# Altium project RK3588.PrjPcb (part 2 of 3)

## Sheet 10.RK3588_VCCIO1_VCCIO3_SARADC.SchDoc
size A3; SheetNumber: 10; SheetTotal: 21
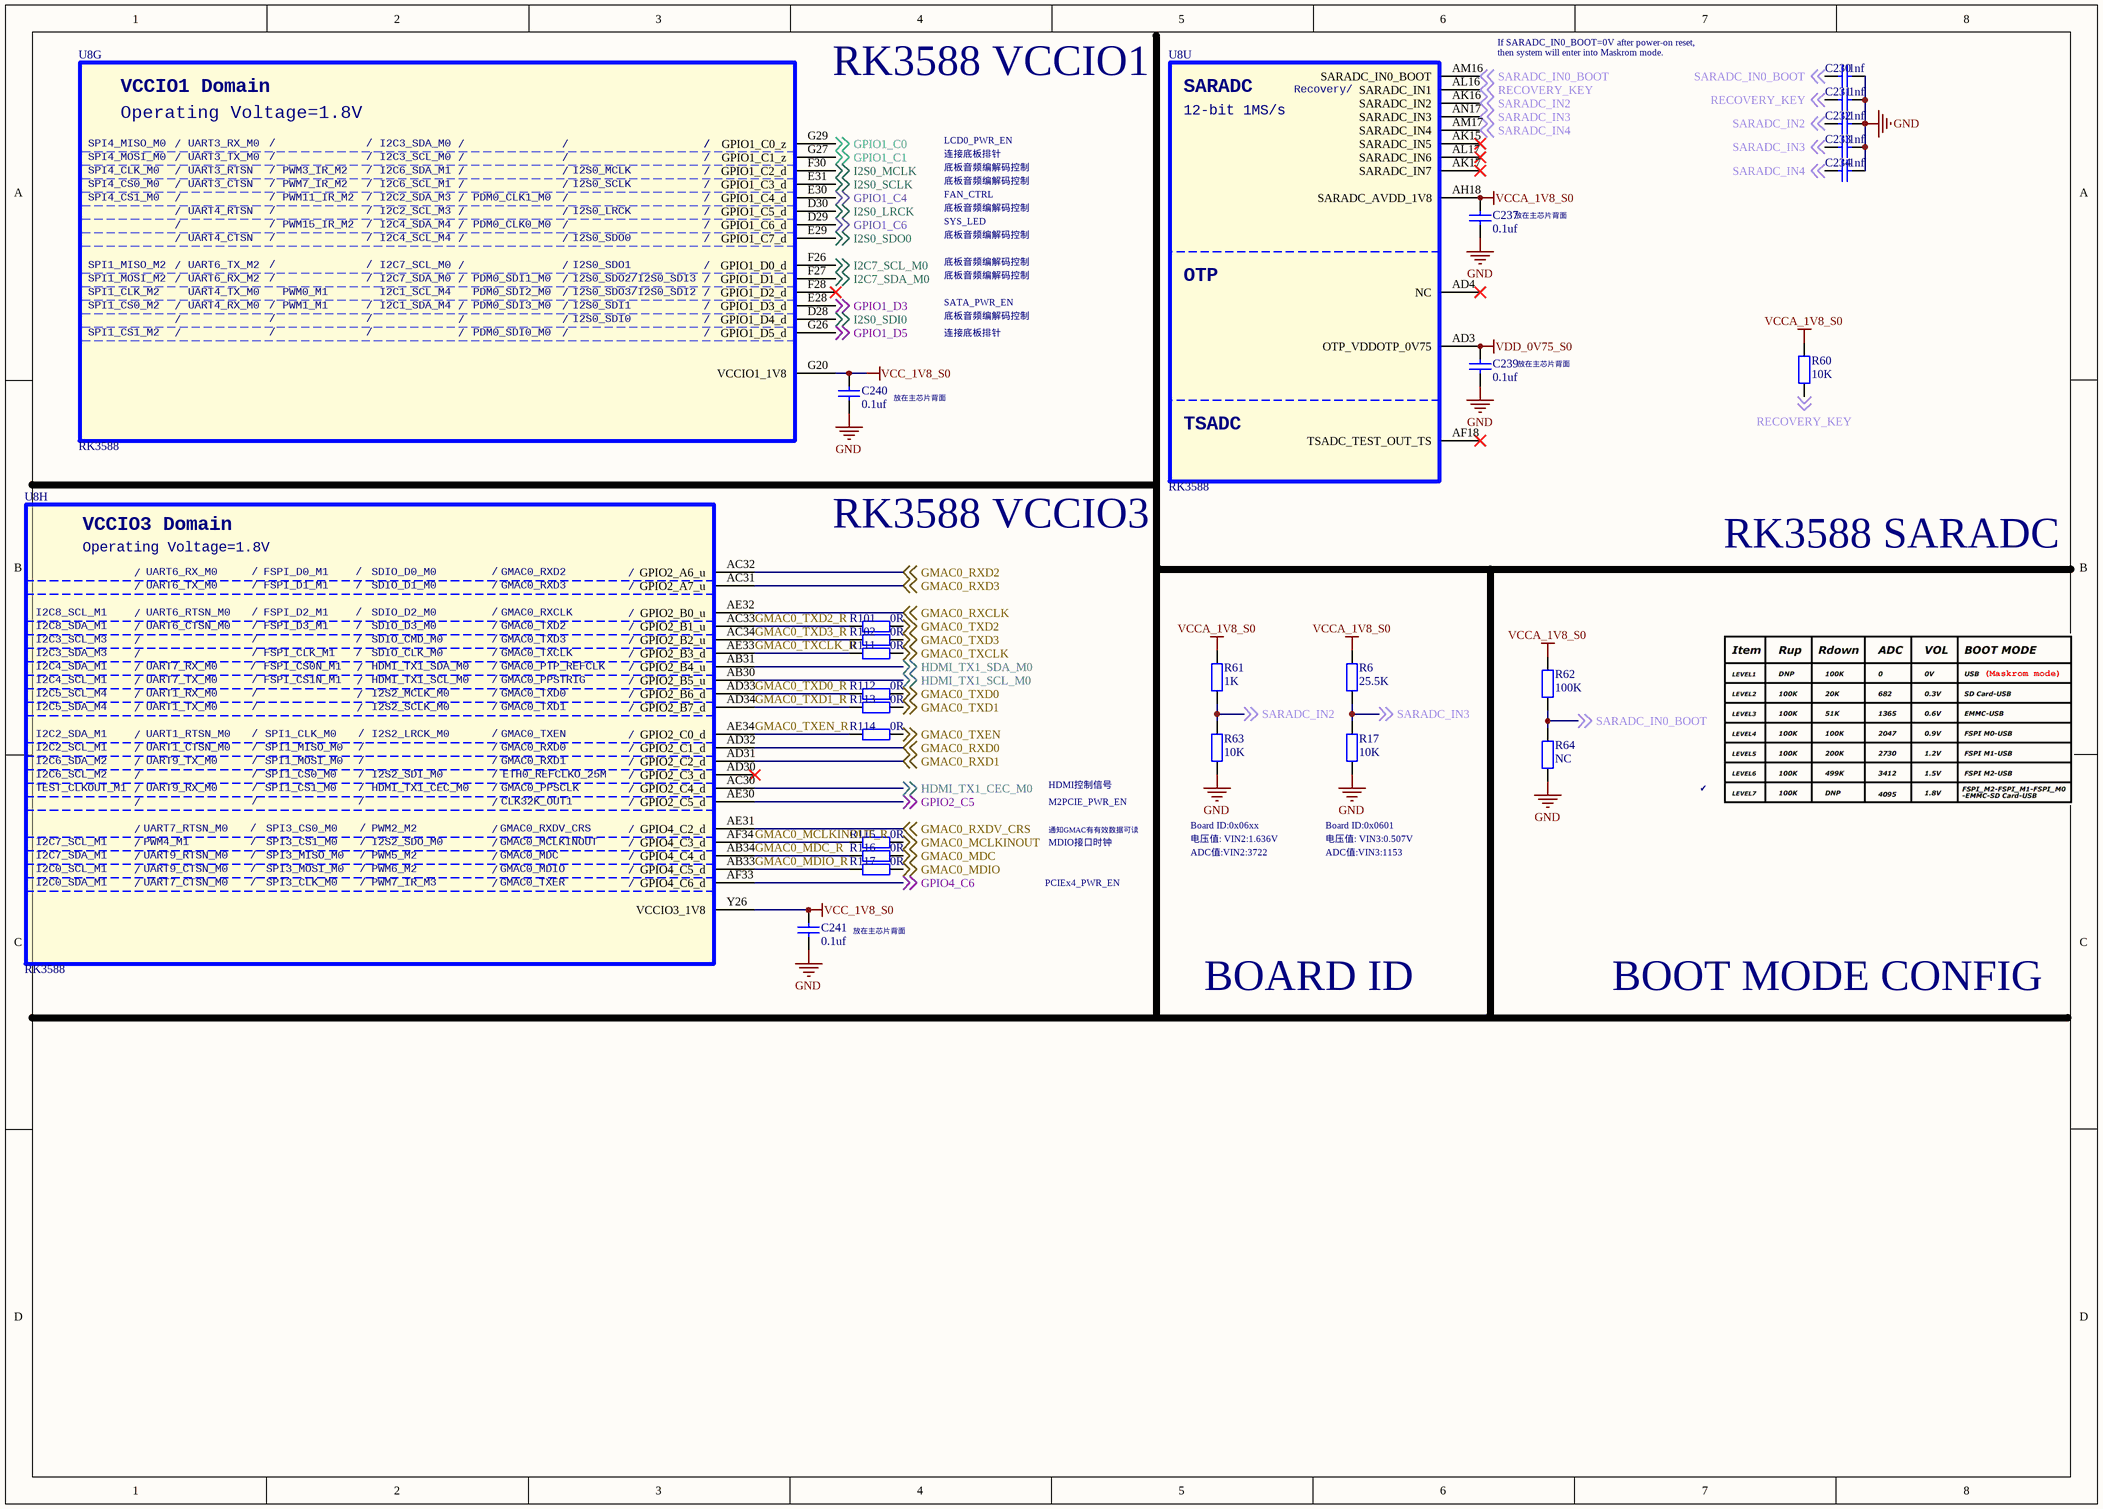
[diagram p9: 10.RK3588_VCCIO1_VCCIO3_SARADC.SchDoc]

### Parts
C230  1nf  [C0201_L]
C231  1nf  [C0201_L]
C232  1nf  [C0201_L]
C233  1nf  [C0201_L]
C234  1nf  [C0201_L]
C237  0.1uf  [C0201_L]
C239  0.1uf  [C0201_L]
C240  0.1uf  [C0201_L]
C241  0.1uf  [C0201_L]
R6  25.5K  [R0402_L]
R17  10K  [R0402_L]
R60  10K  [R0402_L]
R61  1K  [R0402_L]
R62  100K  [R0402_L]
R63  10K  [R0402_L]
R64  NC  [R0402_L]
R101  0R  [R0201_L]
R102  0R  [R0201_L]
R111  0R  [R0201_L]
R112  0R  [R0201_L]
R113  0R  [R0201_L]
R114  0R  [R0201_L]
R115  0R  [R0201_L]
R116  0R  [R0201_L]
R117  0R  [R0201_L]
U8  RK3588  [BGA1088_23R00X23R00X2R00]  (parts G,H,U of 26)

### Nets
GND: C230.2 C231.2 C232.2 C233.2 C234.2 C237.1 C239.1 C240.1 C241.1 R17.1 R63.1 R64.1
VCC_1V8_S0: C240.2 C241.2 U8.G20(VCCIO1_1V8) U8.Y26(VCCIO3_1V8)
VCCA_1V8_S0: C237.2 R6.2 R60.2 R61.2 R62.2 U8.AH18(SARADC_AVDD_1V8)  [project net AVDD1V8_DDR_PLL_S0]
VDD_0V75_S0: C239.2 U8.AD3(OTP_VDDOTP_0V75)
GMAC0_MCLKINOUT: R115.2 ; off-sheet GMAC0_MCLKINOUT
GMAC0_MCLKINOUT_R: R115.1 U8.AF34(GPIO4_C3_d)
GMAC0_MDC: R116.2 ; off-sheet GMAC0_MDC
GMAC0_MDC_R: R116.1 U8.AB34(GPIO4_C4_d)
GMAC0_MDIO: R117.2 ; off-sheet GMAC0_MDIO
GMAC0_MDIO_R: R117.1 U8.AB33(GPIO4_C5_d)
GMAC0_RXCLK: U8.AE32(GPIO2_B0_u) ; off-sheet GMAC0_RXCLK
GMAC0_RXD0: U8.AD32(GPIO2_C1_d) ; off-sheet GMAC0_RXD0
GMAC0_RXD1: U8.AD31(GPIO2_C2_d) ; off-sheet GMAC0_RXD1
GMAC0_RXD2: U8.AC32(GPIO2_A6_u) ; off-sheet GMAC0_RXD2
GMAC0_RXD3: U8.AC31(GPIO2_A7_u) ; off-sheet GMAC0_RXD3
GMAC0_RXDV_CRS: U8.AE31(GPIO4_C2_d) ; off-sheet GMAC0_RXDV_CRS
GMAC0_TXCLK: R111.2 ; off-sheet GMAC0_TXCLK
GMAC0_TXCLK_R: R111.1 U8.AE33(GPIO2_B3_d)
GMAC0_TXD0: R112.2 ; off-sheet GMAC0_TXD0
GMAC0_TXD0_R: R112.1 U8.AD33(GPIO2_B6_d)
GMAC0_TXD1: R113.2 ; off-sheet GMAC0_TXD1
GMAC0_TXD1_R: R113.1 U8.AD34(GPIO2_B7_d)
GMAC0_TXD2: R101.2 ; off-sheet GMAC0_TXD2
GMAC0_TXD2_R: R101.1 U8.AC33(GPIO2_B1_u)
GMAC0_TXD3: R102.2 ; off-sheet GMAC0_TXD3
GMAC0_TXD3_R: R102.1 U8.AC34(GPIO2_B2_u)
GMAC0_TXEN: R114.2 ; off-sheet GMAC0_TXEN
GMAC0_TXEN_R: R114.1 U8.AE34(GPIO2_C0_d)
GPIO1_C0: U8.G29(GPIO1_C0_z) ; off-sheet GPIO1_C0
GPIO1_C1: U8.G27(GPIO1_C1_z) ; off-sheet GPIO1_C1
GPIO1_C4: U8.E30(GPIO1_C4_d) ; off-sheet GPIO1_C4
GPIO1_C6: U8.D29(GPIO1_C6_d) ; off-sheet GPIO1_C6
GPIO1_D3: U8.E28(GPIO1_D3_d) ; off-sheet GPIO1_D3
GPIO1_D5: U8.G26(GPIO1_D5_d) ; off-sheet GPIO1_D5
GPIO2_C5: U8.AE30(GPIO2_C5_d) ; off-sheet GPIO2_C5
GPIO4_C6: U8.AF33(GPIO4_C6_d) ; off-sheet GPIO4_C6
HDMI_TX1_CEC_M0: U8.AC30(GPIO2_C4_d) ; off-sheet HDMI_TX1_CEC_M0
HDMI_TX1_SCL_M0: U8.AB30(GPIO2_B5_u) ; off-sheet HDMI_TX1_SCL_M0
HDMI_TX1_SDA_M0: U8.AB31(GPIO2_B4_u) ; off-sheet HDMI_TX1_SDA_M0
I2C7_SCL_M0: U8.F26(GPIO1_D0_d) ; off-sheet I2C7_SCL_M0
I2C7_SDA_M0: U8.F27(GPIO1_D1_d) ; off-sheet I2C7_SDA_M0
I2S0_LRCK: U8.D30(GPIO1_C5_d) ; off-sheet I2S0_LRCK
I2S0_MCLK: U8.F30(GPIO1_C2_d) ; off-sheet I2S0_MCLK
I2S0_SCLK: U8.E31(GPIO1_C3_d) ; off-sheet I2S0_SCLK
I2S0_SDI0: U8.D28(GPIO1_D4_d) ; off-sheet I2S0_SDI0
I2S0_SDO0: U8.E29(GPIO1_C7_d) ; off-sheet I2S0_SDO0
RECOVERY_KEY: C231.1 R60.1 U8.AL16(SARADC_IN1) ; off-sheet RECOVERY_KEY
SARADC_IN0_BOOT: C230.1 R62.1 R64.2 U8.AM16(SARADC_IN0_BOOT) ; off-sheet SARADC_IN0_BOOT
SARADC_IN2: C232.1 R61.1 R63.2 U8.AK16(SARADC_IN2) ; off-sheet SARADC_IN2
SARADC_IN3: C233.1 R6.1 R17.2 U8.AN17(SARADC_IN3) ; off-sheet SARADC_IN3
SARADC_IN4: C234.1 U8.AM17(SARADC_IN4) ; off-sheet SARADC_IN4

Not connected (* = marked no-connect by the designer): U8 AD4(NC)* AD30(GPIO2_C3_d)* AF18(TSADC_TEST_OUT_TS)* AK15(SARADC_IN5)* AK17(SARADC_IN7)* AL17(SARADC_IN6)* F28(GPIO1_D2_d)*

### Notes on the sheet
- If SARADC_IN0_BOOT=0V after power-on reset,
- RK3588 VCCIO1
- then system will enter into Maskrom mode.
- LCD0_PWR_EN
- 底板音频编解码控制
- 连接底板排针
- FAN_CTRL
- SYS_LED
- (near C237) 放在主芯片背面
- SATA_PWR_EN
- (near C239) 放在主芯片背面
- (near C240) 放在主芯片背面
- RK3588 VCCIO3
- RK3588 SARADC
- HDMI控制信号
- 通知GMAC有有效数据可读
- MDIO接口时钟
- M2PCIE_PWR_EN
- Board ID:0x06xx
- 电压值: VIN2:1.636V
- ADC值:VIN2:3722
- Board ID:0x0601
- 电压值: VIN3:0.507V
- ADC值:VIN3:1153
- ✔
- PCIEx4_PWR_EN
- 放在主芯片背面
- BOARD ID
- BOOT MODE CONFIG
- (in symbol SOC_RK3588, part G) VCCIO1 Domain; Operating Voltage=1.8V; SPI4_MISO_M0; /; UART3_RX_M0; I2C3_SDA_M0; SPI4_MOSI_M0; UART3_TX_M0; I2C3_SCL_M0; SPI4_CLK_M0; UART3_RTSN; PWM3_IR_M2; I2C6_SDA_M1; I2S0_MCLK; SPI4_CS0_M0; UART3_CTSN; PWM7_IR_M2; I2C6_SCL_M1; I2S0_SCLK; SPI4_CS1_M0; PWM11_IR_M2; I2C2_SDA_M3; PDM0_CLK1_M0; UART4_RTSN; I2C2_SCL_M3; I2S0_LRCK; PWM15_IR_M2; I2C4_SDA_M4; PDM0_CLK0_M0; UART4_CTSN; I2C4_SCL_M4; I2S0_SDO0; SPI1_MISO_M2; UART6_TX_M2; I2C7_SCL_M0; I2S0_SDO1; SPI1_MOSI_M2; UART6_RX_M2; I2C7_SDA_M0; PDM0_SDI1_M0; I2S0_SDO2/I2S0_SDI3; SPI1_CLK_M2; UART4_TX_M0; PWM0_M1; I2C1_SCL_M4; PDM0_SDI2_M0; I2S0_SDO3/I2S0_SDI2; SPI1_CS0_M2; UART4_RX_M0; PWM1_M1; I2C1_SDA_M4; PDM0_SDI3_M0; I2S0_SDI1; I2S0_SDI0; SPI1_CS1_M2; PDM0_SDI0_M0
- (in symbol SOC_RK3588, part H) VCCIO3 Domain; Operating Voltage=1.8V; /; UART6_RX_M0; FSPI_D0_M1; SDIO_D0_M0; GMAC0_RXD2; UART6_TX_M0; FSPI_D1_M1; SDIO_D1_M0; GMAC0_RXD3; I2C8_SCL_M1; UART6_RTSN_M0; FSPI_D2_M1; SDIO_D2_M0; GMAC0_RXCLK; I2C8_SDA_M1; UART6_CTSN_M0; FSPI_D3_M1; SDIO_D3_M0; GMAC0_TXD2; I2C3_SCL_M3; SDIO_CMD_M0; GMAC0_TXD3; I2C3_SDA_M3; FSPI_CLK_M1; SDIO_CLK_M0; GMAC0_TXCLK; I2C4_SDA_M1; UART7_RX_M0; FSPI_CS0N_M1; HDMI_TX1_SDA_M0; GMAC0_PTP_REFCLK; I2C4_SCL_M1; UART7_TX_M0; FSPI_CS1N_M1; HDMI_TX1_SCL_M0; GMAC0_PPSTRIG; I2C5_SCL_M4; UART1_RX_M0; I2S2_MCLK_M0; GMAC0_TXD0; I2C5_SDA_M4; UART1_TX_M0; I2S2_SCLK_M0; GMAC0_TXD1; I2C2_SDA_M1; UART1_RTSN_M0; SPI1_CLK_M0; I2S2_LRCK_M0; GMAC0_TXEN; I2C2_SCL_M1; UART1_CTSN_M0; SPI1_MISO_M0; GMAC0_RXD0; I2C6_SDA_M2; UART9_TX_M0; SPI1_MOSI_M0; GMAC0_RXD1; I2C6_SCL_M2; SPI1_CS0_M0; I2S2_SDI_M0; ETH0_REFCLKO_25M; TEST_CLKOUT_M1; UART9_RX_M0; SPI1_CS1_M0; HDMI_TX1_CEC_M0; GMAC0_PPSCLK; CLK32K_OUT1; UART7_RTSN_M0; SPI3_CS0_M0; PWM2_M2; GMAC0_RXDV_CRS; I2C7_SCL_M1; PWM4_M1; SPI3_CS1_M0; I2S2_SDO_M0; GMAC0_MCLKINOUT; I2C7_SDA_M1; UART9_RTSN_M0; SPI3_MISO_M0; PWM5_M2; GMAC0_MDC; I2C0_SCL_M1; UART9_CTSN_M0; SPI3_MOSI_M0; PWM6_M2; GMAC0_MDIO; I2C0_SDA_M1; UART7_CTSN_M0; SPI3_CLK_M0; PWM7_IR_M3; GMAC0_TXER
- (in symbol SOC_RK3588, part U) SARADC; Recovery/; 12-bit 1MS/s; OTP; TSADC

### Library data of the parts
C230-C234 C237 C239-C241 = C: 贴片电容/MLCC电容
R6 R17 R60-R64 R101 R102 R111-R117 = R: 贴片电阻
U8 = SOC_RK3588: ROCKCHIP SOC

## Sheet 11.RK3588_MIPI_D_C_PHY0_1.SchDoc
size A3; SheetNumber: 11; SheetTotal: 21
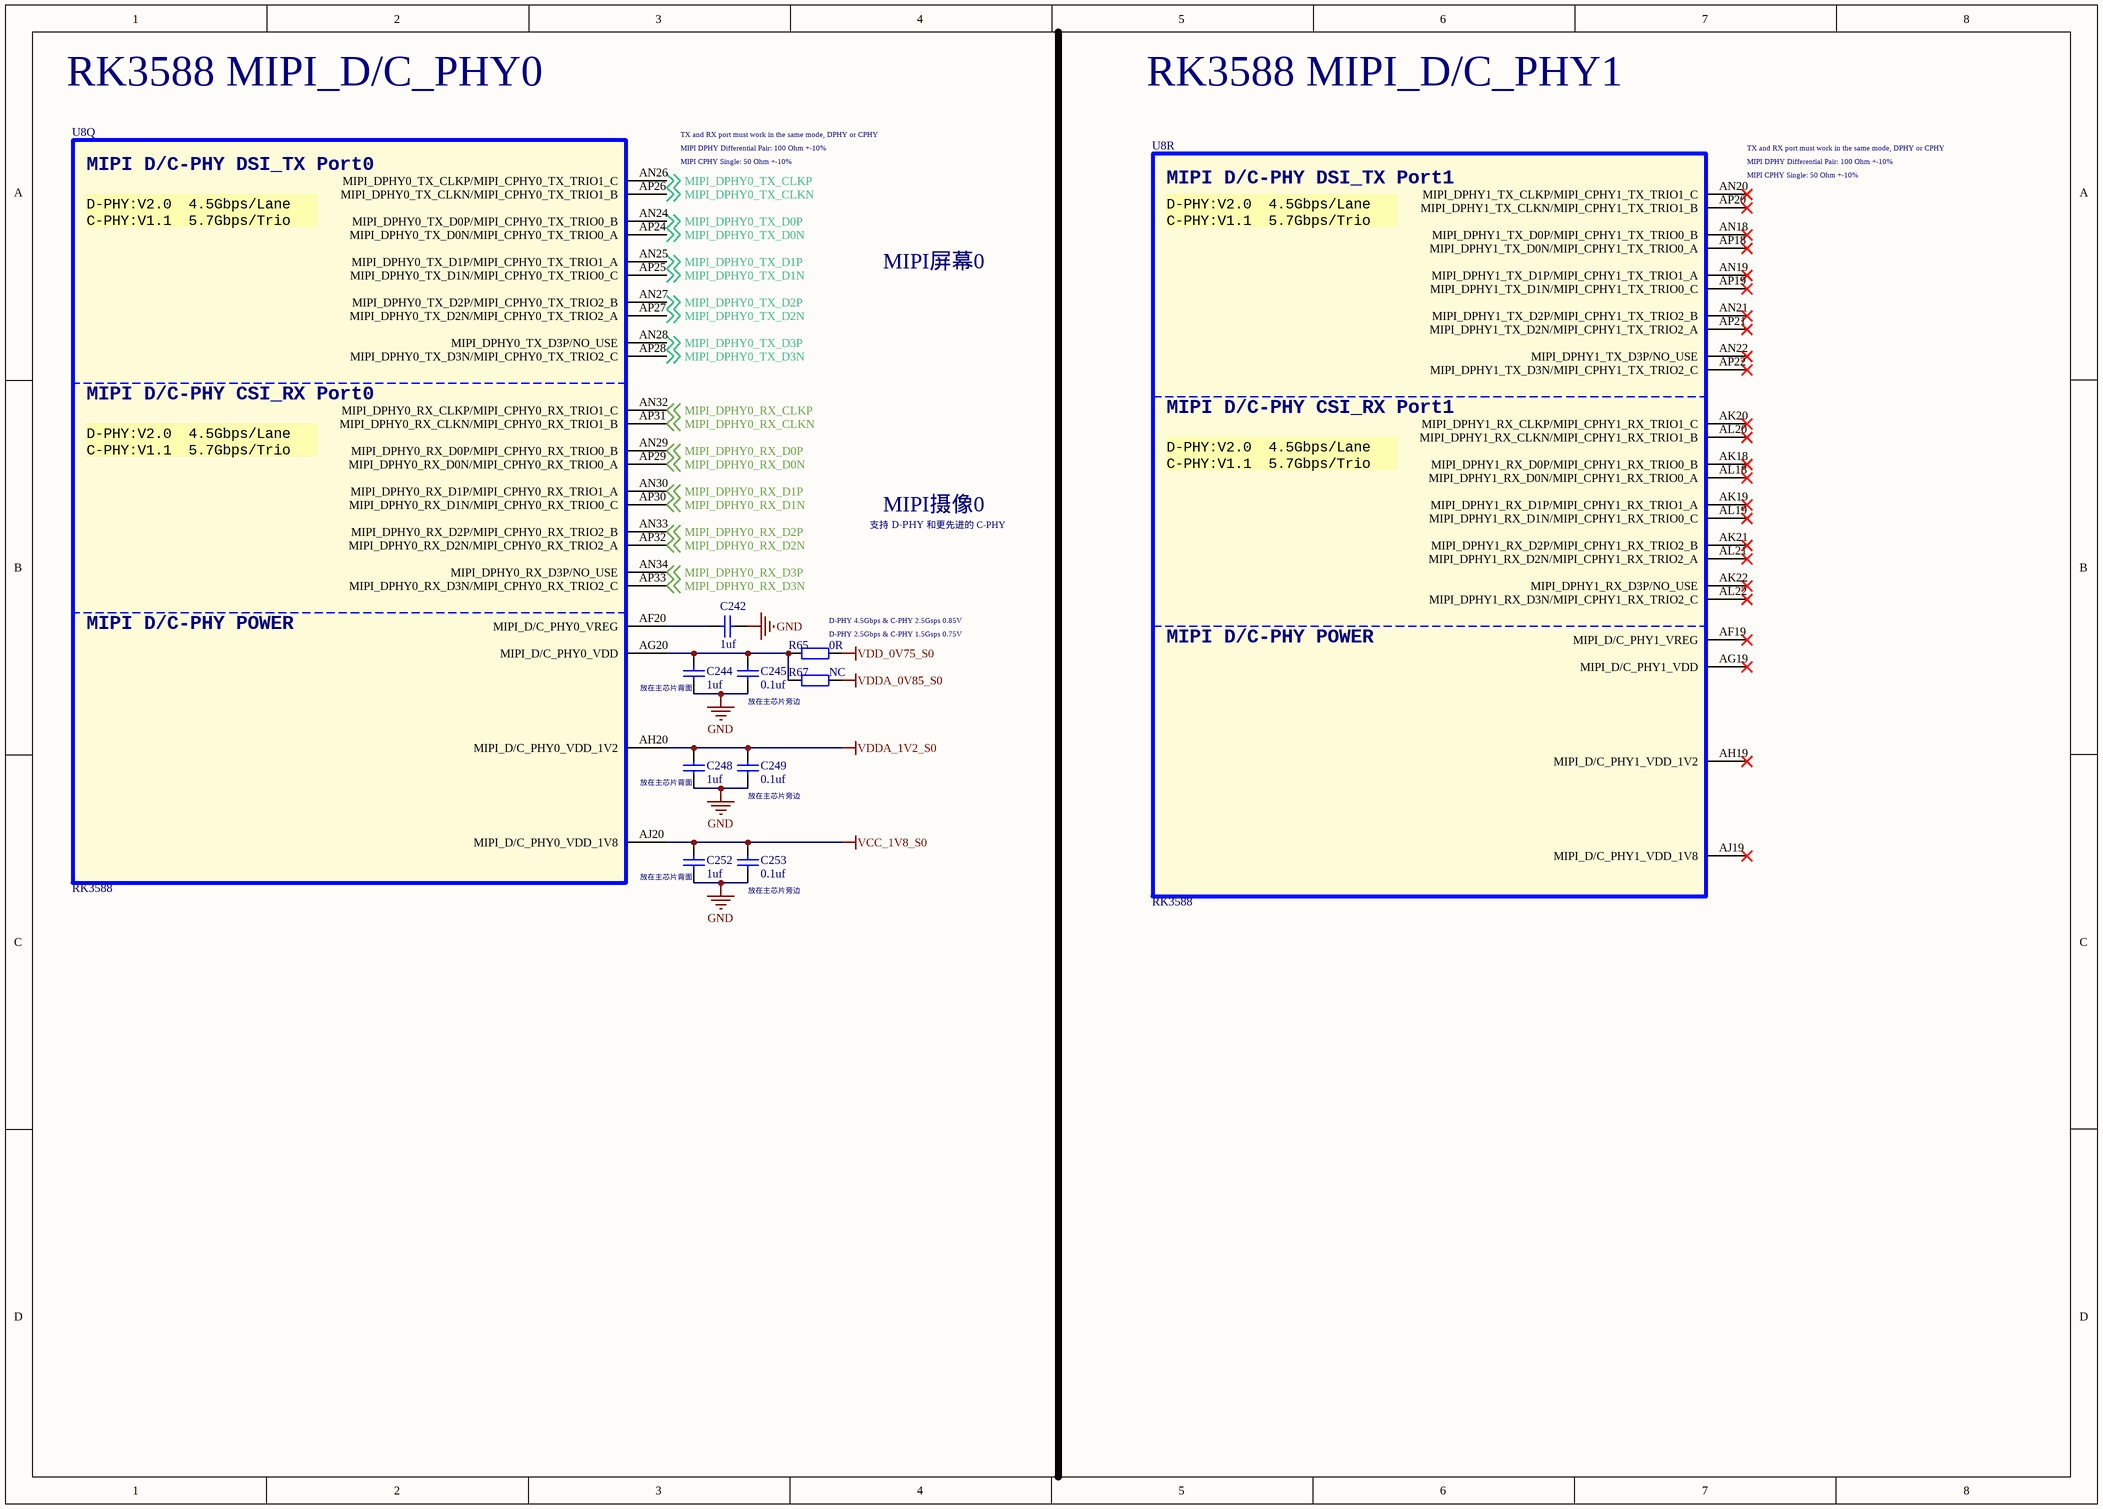
[diagram p10: 11.RK3588_MIPI_D_C_PHY0_1.SchDoc]

### Parts
C242  1uf  [C0201_L]
C244  1uf  [C0201_L]
C245  0.1uf  [C0201_L]
C248  1uf  [C0201_L]
C249  0.1uf  [C0201_L]
C252  1uf  [C0201_L]
C253  0.1uf  [C0201_L]
R65  0R  [R0402_L]
R67  NC  [R0402_L]
U8  RK3588  [BGA1088_23R00X23R00X2R00]  (parts Q,R of 26)

### Nets
GND: C242.2 C244.1 C245.1 C248.1 C249.1 C252.1 C253.1
VCC_1V8_S0: C252.2 C253.2 U8.AJ20(MIPI_D/C_PHY0_VDD_1V8)
VDD_0V75_S0: R65.2
VDDA_0V85_S0: R67.2
VDDA_1V2_S0: C248.2 C249.2 U8.AH20(MIPI_D/C_PHY0_VDD_1V2)
MIPI_DPHY0_RX_CLKN: U8.AP31(MIPI_DPHY0_RX_CLKN/MIPI_CPHY0_RX_TRIO1_B) ; off-sheet MIPI_DPHY0_RX_CLKN
MIPI_DPHY0_RX_CLKP: U8.AN32(MIPI_DPHY0_RX_CLKP/MIPI_CPHY0_RX_TRIO1_C) ; off-sheet MIPI_DPHY0_RX_CLKP
MIPI_DPHY0_RX_D0N: U8.AP29(MIPI_DPHY0_RX_D0N/MIPI_CPHY0_RX_TRIO0_A) ; off-sheet MIPI_DPHY0_RX_D0N
MIPI_DPHY0_RX_D0P: U8.AN29(MIPI_DPHY0_RX_D0P/MIPI_CPHY0_RX_TRIO0_B) ; off-sheet MIPI_DPHY0_RX_D0P
MIPI_DPHY0_RX_D1N: U8.AP30(MIPI_DPHY0_RX_D1N/MIPI_CPHY0_RX_TRIO0_C) ; off-sheet MIPI_DPHY0_RX_D1N
MIPI_DPHY0_RX_D1P: U8.AN30(MIPI_DPHY0_RX_D1P/MIPI_CPHY0_RX_TRIO1_A) ; off-sheet MIPI_DPHY0_RX_D1P
MIPI_DPHY0_RX_D2N: U8.AP32(MIPI_DPHY0_RX_D2N/MIPI_CPHY0_RX_TRIO2_A) ; off-sheet MIPI_DPHY0_RX_D2N
MIPI_DPHY0_RX_D2P: U8.AN33(MIPI_DPHY0_RX_D2P/MIPI_CPHY0_RX_TRIO2_B) ; off-sheet MIPI_DPHY0_RX_D2P
MIPI_DPHY0_RX_D3N: U8.AP33(MIPI_DPHY0_RX_D3N/MIPI_CPHY0_RX_TRIO2_C) ; off-sheet MIPI_DPHY0_RX_D3N
MIPI_DPHY0_RX_D3P: U8.AN34(MIPI_DPHY0_RX_D3P/NO_USE) ; off-sheet MIPI_DPHY0_RX_D3P
MIPI_DPHY0_TX_CLKN: U8.AP26(MIPI_DPHY0_TX_CLKN/MIPI_CPHY0_TX_TRIO1_B) ; off-sheet MIPI_DPHY0_TX_CLKN
MIPI_DPHY0_TX_CLKP: U8.AN26(MIPI_DPHY0_TX_CLKP/MIPI_CPHY0_TX_TRIO1_C) ; off-sheet MIPI_DPHY0_TX_CLKP
MIPI_DPHY0_TX_D0N: U8.AP24(MIPI_DPHY0_TX_D0N/MIPI_CPHY0_TX_TRIO0_A) ; off-sheet MIPI_DPHY0_TX_D0N
MIPI_DPHY0_TX_D0P: U8.AN24(MIPI_DPHY0_TX_D0P/MIPI_CPHY0_TX_TRIO0_B) ; off-sheet MIPI_DPHY0_TX_D0P
MIPI_DPHY0_TX_D1N: U8.AP25(MIPI_DPHY0_TX_D1N/MIPI_CPHY0_TX_TRIO0_C) ; off-sheet MIPI_DPHY0_TX_D1N
MIPI_DPHY0_TX_D1P: U8.AN25(MIPI_DPHY0_TX_D1P/MIPI_CPHY0_TX_TRIO1_A) ; off-sheet MIPI_DPHY0_TX_D1P
MIPI_DPHY0_TX_D2N: U8.AP27(MIPI_DPHY0_TX_D2N/MIPI_CPHY0_TX_TRIO2_A) ; off-sheet MIPI_DPHY0_TX_D2N
MIPI_DPHY0_TX_D2P: U8.AN27(MIPI_DPHY0_TX_D2P/MIPI_CPHY0_TX_TRIO2_B) ; off-sheet MIPI_DPHY0_TX_D2P
MIPI_DPHY0_TX_D3N: U8.AP28(MIPI_DPHY0_TX_D3N/MIPI_CPHY0_TX_TRIO2_C) ; off-sheet MIPI_DPHY0_TX_D3N
MIPI_DPHY0_TX_D3P: U8.AN28(MIPI_DPHY0_TX_D3P/NO_USE) ; off-sheet MIPI_DPHY0_TX_D3P
NetC242_1: C242.1 U8.AF20(MIPI_D/C_PHY0_VREG)
NetC244_2: C244.2 C245.2 R65.1 R67.1 U8.AG20(MIPI_D/C_PHY0_VDD)

Not connected (* = marked no-connect by the designer): U8 AF19(MIPI_D/C_PHY1_VREG)* AG19(MIPI_D/C_PHY1_VDD)* AH19(MIPI_D/C_PHY1_VDD_1V2)* AJ19(MIPI_D/C_PHY1_VDD_1V8)* AK18(MIPI_DPHY1_RX_D0P/MIPI_CPHY1_RX_TRIO0_B)* AK19(MIPI_DPHY1_RX_D1P/MIPI_CPHY1_RX_TRIO1_A)* AK20(MIPI_DPHY1_RX_CLKP/MIPI_CPHY1_RX_TRIO1_C)* AK21(MIPI_DPHY1_RX_D2P/MIPI_CPHY1_RX_TRIO2_B)* AK22(MIPI_DPHY1_RX_D3P/NO_USE)* AL18(MIPI_DPHY1_RX_D0N/MIPI_CPHY1_RX_TRIO0_A)* AL19(MIPI_DPHY1_RX_D1N/MIPI_CPHY1_RX_TRIO0_C)* AL20(MIPI_DPHY1_RX_CLKN/MIPI_CPHY1_RX_TRIO1_B)* AL21(MIPI_DPHY1_RX_D2N/MIPI_CPHY1_RX_TRIO2_A)* AL22(MIPI_DPHY1_RX_D3N/MIPI_CPHY1_RX_TRIO2_C)* AN18(MIPI_DPHY1_TX_D0P/MIPI_CPHY1_TX_TRIO0_B)* AN19(MIPI_DPHY1_TX_D1P/MIPI_CPHY1_TX_TRIO1_A)* AN20(MIPI_DPHY1_TX_CLKP/MIPI_CPHY1_TX_TRIO1_C)* AN21(MIPI_DPHY1_TX_D2P/MIPI_CPHY1_TX_TRIO2_B)* AN22(MIPI_DPHY1_TX_D3P/NO_USE)* AP18(MIPI_DPHY1_TX_D0N/MIPI_CPHY1_TX_TRIO0_A)* AP19(MIPI_DPHY1_TX_D1N/MIPI_CPHY1_TX_TRIO0_C)* AP20(MIPI_DPHY1_TX_CLKN/MIPI_CPHY1_TX_TRIO1_B)* AP21(MIPI_DPHY1_TX_D2N/MIPI_CPHY1_TX_TRIO2_A)* AP22(MIPI_DPHY1_TX_D3N/MIPI_CPHY1_TX_TRIO2_C)*

### Notes on the sheet
- RK3588 MIPI_D/C_PHY0
- RK3588 MIPI_D/C_PHY1
- TX and RX port must work in the same mode, DPHY or CPHY
- MIPI DPHY Differential Pair: 100 Ohm +-10%
- MIPI CPHY Single: 50 Ohm +-10%
- (near U8) MIPI DPHY Differential Pair: 100 Ohm +-10%
- (near U8) MIPI CPHY Single: 50 Ohm +-10%
- MIPI屏幕0
- MIPI摄像0
- 支持 D-PHY​ 和更先进的 C-PHY
- (near R65) D-PHY 4.5Gbps & C-PHY 2.5Gsps 0.85V
- (near R65) D-PHY 2.5Gbps & C-PHY 1.5Gsps 0.75V
- (near U8) 放在主芯片背面
- (near C245) 放在主芯片旁边
- (near C249) 放在主芯片旁边
- 放在主芯片背面
- (near C253) 放在主芯片旁边
- (in symbol SOC_RK3588, part Q) MIPI D/C-PHY DSI_TX Port0; D-PHY:V2.0  4.5Gbps/Lane / C-PHY:V1.1  5.7Gbps/Trio; MIPI D/C-PHY CSI_RX Port0; MIPI D/C-PHY POWER
- (in symbol SOC_RK3588, part R) MIPI D/C-PHY DSI_TX Port1; D-PHY:V2.0  4.5Gbps/Lane / C-PHY:V1.1  5.7Gbps/Trio; MIPI D/C-PHY CSI_RX Port1; MIPI D/C-PHY POWER

### Library data of the parts
C242 C244 C245 C248 C249 C252 C253 = C: 贴片电容/MLCC电容
R65 R67 = R: 贴片电阻
U8 = SOC_RK3588: ROCKCHIP SOC

## Sheet 12.RK3588_MIPI_CSI_HDMI2.1_HDMI.SchDoc
size A3; SheetNumber: 12; SheetTotal: 21
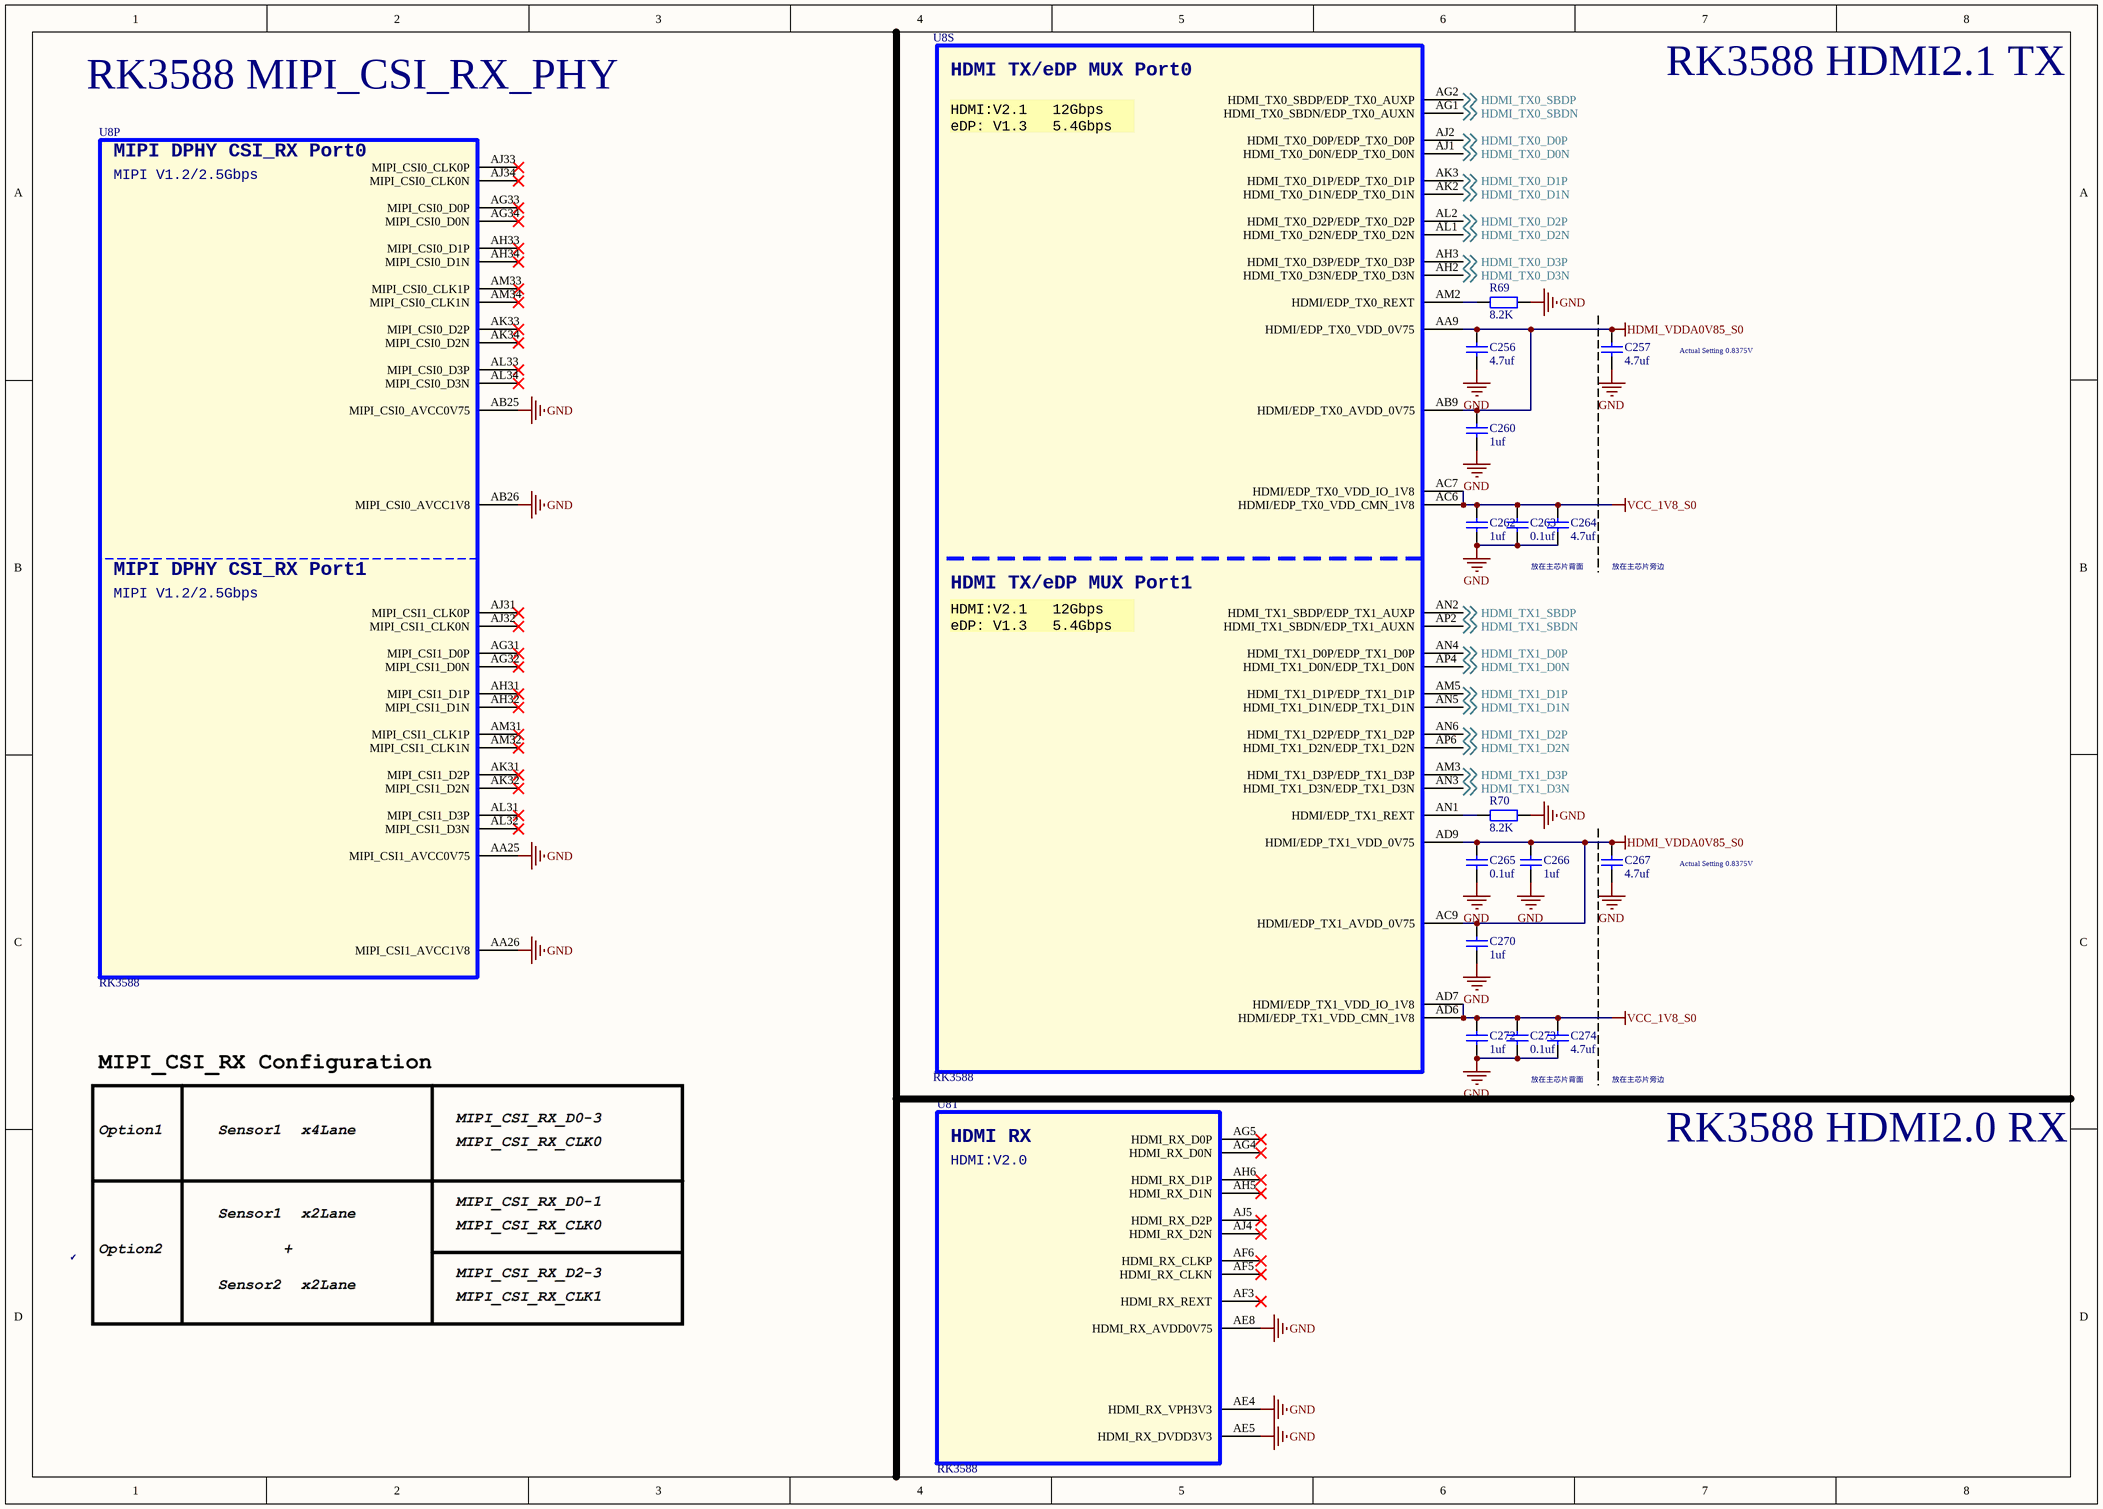
[diagram p11: 12.RK3588_MIPI_CSI_HDMI2.1_HDMI.SchDoc]

### Parts
C256  4.7uf  [C0402_L]
C257  4.7uf  [C0402_L]
C260  1uf  [C0201_L]
C262  1uf  [C0201_L]
C263  0.1uf  [C0201_L]
C264  4.7uf  [C0201_L]
C265  0.1uf  [C0201_L]
C266  1uf  [C0201_L]
C267  4.7uf  [C0402_L]
C270  1uf  [C0201_L]
C272  1uf  [C0201_L]
C273  0.1uf  [C0201_L]
C274  4.7uf  [C0402_L]
R69  8.2K  [R0201_L]
R70  8.2K  [R0201_L]
U8  RK3588  [BGA1088_23R00X23R00X2R00]  (parts P,S,T of 26)

### Nets
GND: C256.1 C257.1 C260.1 C262.1 C263.1 C264.1 C265.1 C266.1 C267.1 C270.1 C272.1 C273.1 C274.1 R69.2 R70.2 U8.AA25(MIPI_CSI1_AVCC0V75) U8.AA26(MIPI_CSI1_AVCC1V8) U8.AB25(MIPI_CSI0_AVCC0V75) U8.AB26(MIPI_CSI0_AVCC1V8) U8.AE4(HDMI_RX_VPH3V3) U8.AE5(HDMI_RX_DVDD3V3) U8.AE8(HDMI_RX_AVDD0V75)
HDMI_VDDA0V85_S0: C256.2 C257.2 C260.2 C265.2 C266.2 C267.2 C270.2 U8.AA9(HDMI/EDP_TX0_VDD_0V75) U8.AB9(HDMI/EDP_TX0_AVDD_0V75) U8.AC9(HDMI/EDP_TX1_AVDD_0V75) U8.AD9(HDMI/EDP_TX1_VDD_0V75)
VCC_1V8_S0: C262.2 C263.2 C264.2 C272.2 C273.2 C274.2 U8.AC6(HDMI/EDP_TX0_VDD_CMN_1V8) U8.AC7(HDMI/EDP_TX0_VDD_IO_1V8) U8.AD6(HDMI/EDP_TX1_VDD_CMN_1V8) U8.AD7(HDMI/EDP_TX1_VDD_IO_1V8)
HDMI_TX0_D0N: U8.AJ1(HDMI_TX0_D0N/EDP_TX0_D0N) ; off-sheet HDMI_TX0_D0N
HDMI_TX0_D0P: U8.AJ2(HDMI_TX0_D0P/EDP_TX0_D0P) ; off-sheet HDMI_TX0_D0P
HDMI_TX0_D1N: U8.AK2(HDMI_TX0_D1N/EDP_TX0_D1N) ; off-sheet HDMI_TX0_D1N
HDMI_TX0_D1P: U8.AK3(HDMI_TX0_D1P/EDP_TX0_D1P) ; off-sheet HDMI_TX0_D1P
HDMI_TX0_D2N: U8.AL1(HDMI_TX0_D2N/EDP_TX0_D2N) ; off-sheet HDMI_TX0_D2N
HDMI_TX0_D2P: U8.AL2(HDMI_TX0_D2P/EDP_TX0_D2P) ; off-sheet HDMI_TX0_D2P
HDMI_TX0_D3N: U8.AH2(HDMI_TX0_D3N/EDP_TX0_D3N) ; off-sheet HDMI_TX0_D3N
HDMI_TX0_D3P: U8.AH3(HDMI_TX0_D3P/EDP_TX0_D3P) ; off-sheet HDMI_TX0_D3P
HDMI_TX0_SBDN: U8.AG1(HDMI_TX0_SBDN/EDP_TX0_AUXN) ; off-sheet HDMI_TX0_SBDN
HDMI_TX0_SBDP: U8.AG2(HDMI_TX0_SBDP/EDP_TX0_AUXP) ; off-sheet HDMI_TX0_SBDP
HDMI_TX1_D0N: U8.AP4(HDMI_TX1_D0N/EDP_TX1_D0N) ; off-sheet HDMI_TX1_D0N
HDMI_TX1_D0P: U8.AN4(HDMI_TX1_D0P/EDP_TX1_D0P) ; off-sheet HDMI_TX1_D0P
HDMI_TX1_D1N: U8.AN5(HDMI_TX1_D1N/EDP_TX1_D1N) ; off-sheet HDMI_TX1_D1N
HDMI_TX1_D1P: U8.AM5(HDMI_TX1_D1P/EDP_TX1_D1P) ; off-sheet HDMI_TX1_D1P
HDMI_TX1_D2N: U8.AP6(HDMI_TX1_D2N/EDP_TX1_D2N) ; off-sheet HDMI_TX1_D2N
HDMI_TX1_D2P: U8.AN6(HDMI_TX1_D2P/EDP_TX1_D2P) ; off-sheet HDMI_TX1_D2P
HDMI_TX1_D3N: U8.AN3(HDMI_TX1_D3N/EDP_TX1_D3N) ; off-sheet HDMI_TX1_D3N
HDMI_TX1_D3P: U8.AM3(HDMI_TX1_D3P/EDP_TX1_D3P) ; off-sheet HDMI_TX1_D3P
HDMI_TX1_SBDN: U8.AP2(HDMI_TX1_SBDN/EDP_TX1_AUXN) ; off-sheet HDMI_TX1_SBDN
HDMI_TX1_SBDP: U8.AN2(HDMI_TX1_SBDP/EDP_TX1_AUXP) ; off-sheet HDMI_TX1_SBDP
NetR69_1: R69.1 U8.AM2(HDMI/EDP_TX0_REXT)
NetR70_1: R70.1 U8.AN1(HDMI/EDP_TX1_REXT)

Not connected (* = marked no-connect by the designer): U8 AF3(HDMI_RX_REXT)* AF5(HDMI_RX_CLKN)* AF6(HDMI_RX_CLKP)* AG4(HDMI_RX_D0N)* AG5(HDMI_RX_D0P)* AG31(MIPI_CSI1_D0P)* AG32(MIPI_CSI1_D0N)* AG33(MIPI_CSI0_D0P)* AG34(MIPI_CSI0_D0N)* AH5(HDMI_RX_D1N)* AH6(HDMI_RX_D1P)* AH31(MIPI_CSI1_D1P)* AH32(MIPI_CSI1_D1N)* AH33(MIPI_CSI0_D1P)* AH34(MIPI_CSI0_D1N)* AJ4(HDMI_RX_D2N)* AJ5(HDMI_RX_D2P)* AJ31(MIPI_CSI1_CLK0P)* AJ32(MIPI_CSI1_CLK0N)* AJ33(MIPI_CSI0_CLK0P)* AJ34(MIPI_CSI0_CLK0N)* AK31(MIPI_CSI1_D2P)* AK32(MIPI_CSI1_D2N)* AK33(MIPI_CSI0_D2P)* AK34(MIPI_CSI0_D2N)* AL31(MIPI_CSI1_D3P)* AL32(MIPI_CSI1_D3N)* AL33(MIPI_CSI0_D3P)* AL34(MIPI_CSI0_D3N)* AM31(MIPI_CSI1_CLK1P)* AM32(MIPI_CSI1_CLK1N)* AM33(MIPI_CSI0_CLK1P)* AM34(MIPI_CSI0_CLK1N)*

### Notes on the sheet
- RK3588 MIPI_CSI_RX_PHY
- RK3588 HDMI2.1 TX
- Actual Setting 0.8375V
- 放在主芯片背面
- 放在主芯片旁边
- RK3588 HDMI2.0 RX
- ✔
- (in symbol SOC_RK3588, part P) MIPI DPHY CSI_RX Port0; MIPI V1.2/2.5Gbps; MIPI DPHY CSI_RX Port1
- (in symbol SOC_RK3588, part S) HDMI TX/eDP MUX Port0; HDMI:V2.1   12Gbps / eDP: V1.3   5.4Gbps; HDMI TX/eDP MUX Port1
- (in symbol SOC_RK3588, part T) HDMI RX; HDMI:V2.0

### Library data of the parts
C256 C257 C260 C262-C267 C270 C272-C274 = C: 贴片电容/MLCC电容
R69 R70 = R: 贴片电阻
U8 = SOC_RK3588: ROCKCHIP SOC

## Sheet 13.RK3588_PCIE2.0_PCIE3.0.SchDoc
size A3; SheetNumber: 13; SheetTotal: 21
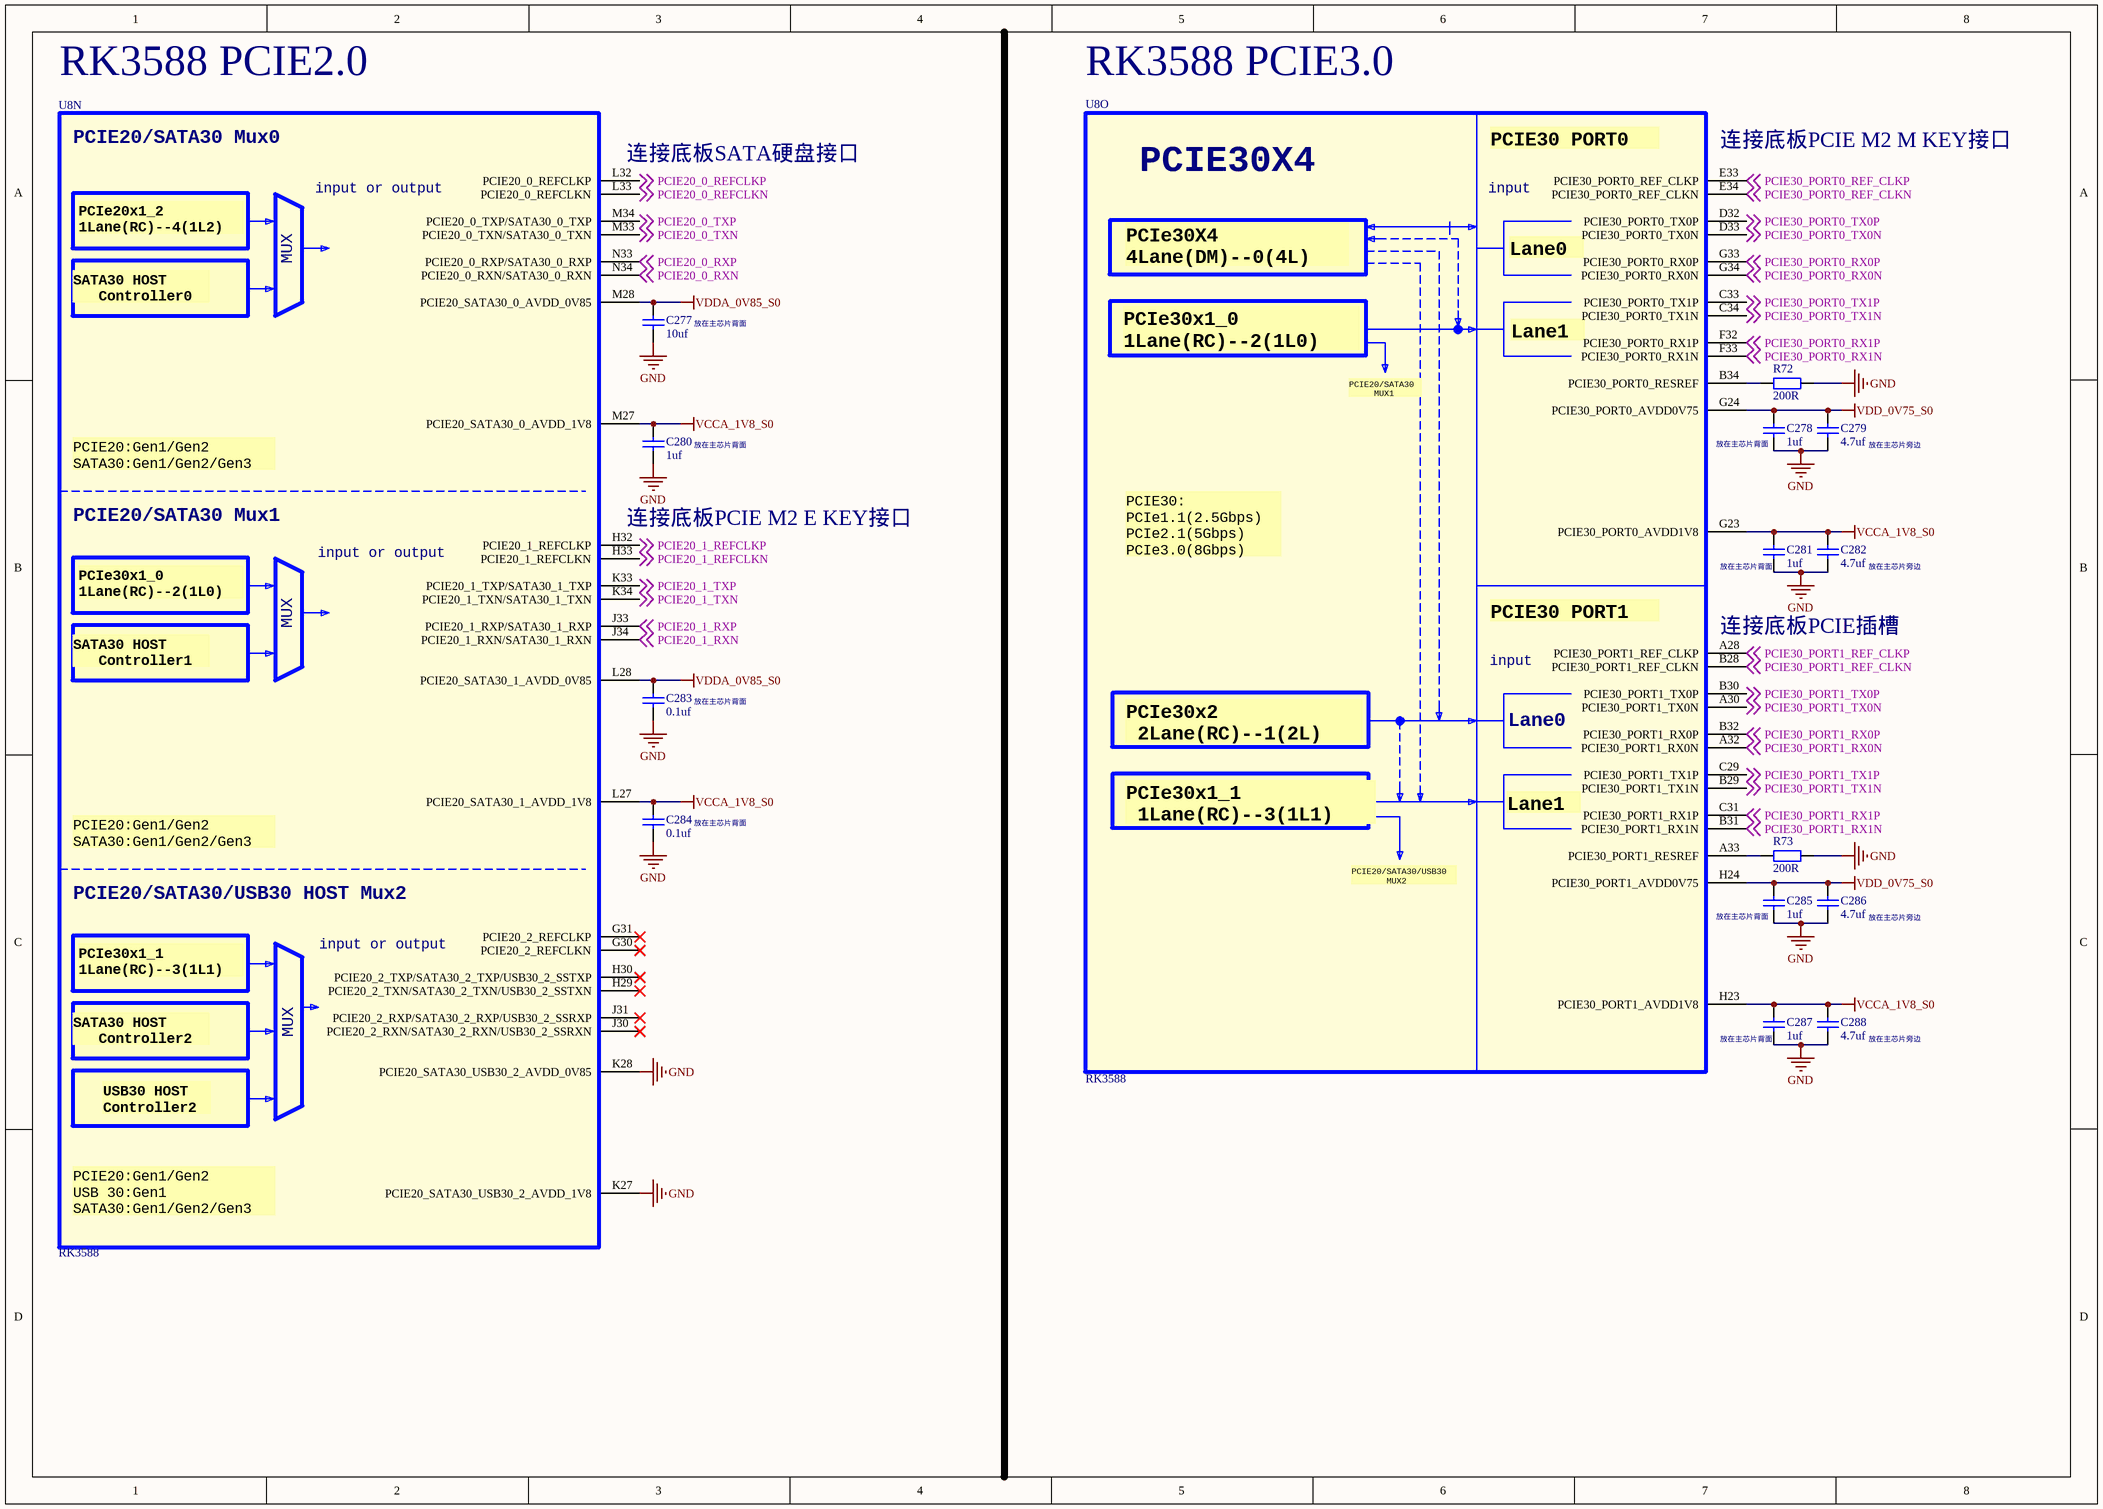
[diagram p12: 13.RK3588_PCIE2.0_PCIE3.0.SchDoc]

### Parts
C277  10uf  [C0201_L]
C278  1uf  [C0201_L]
C279  4.7uf  [C0402_L]
C280  1uf  [C0201_L]
C281  1uf  [C0201_L]
C282  4.7uf  [C0402_L]
C283  0.1uf  [C0201_L]
C284  0.1uf  [C0201_L]
C285  1uf  [C0201_L]
C286  4.7uf  [C0402_L]
C287  1uf  [C0201_L]
C288  4.7uf  [C0402_L]
R72  200R  [R0201_L]
R73  200R  [R0201_L]
U8  RK3588  [BGA1088_23R00X23R00X2R00]  (parts N,O of 26)

### Nets
GND: C277.1 C278.1 C279.1 C280.1 C281.1 C282.1 C283.1 C284.1 C285.1 C286.1 C287.1 C288.1 R72.2 R73.2 U8.K27(PCIE20_SATA30_USB30_2_AVDD_1V8) U8.K28(PCIE20_SATA30_USB30_2_AVDD_0V85)
VCCA_1V8_S0: C280.2 C281.2 C282.2 C284.2 C287.2 C288.2 U8.G23(PCIE30_PORT0_AVDD1V8) U8.H23(PCIE30_PORT1_AVDD1V8) U8.L27(PCIE20_SATA30_1_AVDD_1V8) U8.M27(PCIE20_SATA30_0_AVDD_1V8)  [project net AVDD1V8_DDR_PLL_S0]
VDD_0V75_S0: C278.2 C279.2 C285.2 C286.2 U8.G24(PCIE30_PORT0_AVDD0V75) U8.H24(PCIE30_PORT1_AVDD0V75)
VDDA_0V85_S0: C277.2 C283.2 U8.L28(PCIE20_SATA30_1_AVDD_0V85) U8.M28(PCIE20_SATA30_0_AVDD_0V85)
PCIE20_0_REFCLKN: U8.L33(PCIE20_0_REFCLKN) ; off-sheet PCIE20_0_REFCLKN
PCIE20_0_REFCLKP: U8.L32(PCIE20_0_REFCLKP) ; off-sheet PCIE20_0_REFCLKP
PCIE20_0_RXN: U8.N34(PCIE20_0_RXN/SATA30_0_RXN) ; off-sheet PCIE20_0_RXN
PCIE20_0_RXP: U8.N33(PCIE20_0_RXP/SATA30_0_RXP) ; off-sheet PCIE20_0_RXP
PCIE20_0_TXN: U8.M33(PCIE20_0_TXN/SATA30_0_TXN) ; off-sheet PCIE20_0_TXN
PCIE20_0_TXP: U8.M34(PCIE20_0_TXP/SATA30_0_TXP) ; off-sheet PCIE20_0_TXP
PCIE20_1_REFCLKN: U8.H33(PCIE20_1_REFCLKN) ; off-sheet PCIE20_1_REFCLKN
PCIE20_1_REFCLKP: U8.H32(PCIE20_1_REFCLKP) ; off-sheet PCIE20_1_REFCLKP
PCIE20_1_RXN: U8.J34(PCIE20_1_RXN/SATA30_1_RXN) ; off-sheet PCIE20_1_RXN
PCIE20_1_RXP: U8.J33(PCIE20_1_RXP/SATA30_1_RXP) ; off-sheet PCIE20_1_RXP
PCIE20_1_TXN: U8.K34(PCIE20_1_TXN/SATA30_1_TXN) ; off-sheet PCIE20_1_TXN
PCIE20_1_TXP: U8.K33(PCIE20_1_TXP/SATA30_1_TXP) ; off-sheet PCIE20_1_TXP
PCIE30_PORT0_REF_CLKN: U8.E34(PCIE30_PORT0_REF_CLKN) ; off-sheet PCIE30_PORT0_REF_CLKN
PCIE30_PORT0_REF_CLKP: U8.E33(PCIE30_PORT0_REF_CLKP) ; off-sheet PCIE30_PORT0_REF_CLKP
PCIE30_PORT0_RX0N: U8.G34(PCIE30_PORT0_RX0N) ; off-sheet PCIE30_PORT0_RX0N
PCIE30_PORT0_RX0P: U8.G33(PCIE30_PORT0_RX0P) ; off-sheet PCIE30_PORT0_RX0P
PCIE30_PORT0_RX1N: U8.F33(PCIE30_PORT0_RX1N) ; off-sheet PCIE30_PORT0_RX1N
PCIE30_PORT0_RX1P: U8.F32(PCIE30_PORT0_RX1P) ; off-sheet PCIE30_PORT0_RX1P
PCIE30_PORT0_TX0N: U8.D33(PCIE30_PORT0_TX0N) ; off-sheet PCIE30_PORT0_TX0N
PCIE30_PORT0_TX0P: U8.D32(PCIE30_PORT0_TX0P) ; off-sheet PCIE30_PORT0_TX0P
PCIE30_PORT0_TX1N: U8.C34(PCIE30_PORT0_TX1N) ; off-sheet PCIE30_PORT0_TX1N
PCIE30_PORT0_TX1P: U8.C33(PCIE30_PORT0_TX1P) ; off-sheet PCIE30_PORT0_TX1P
PCIE30_PORT1_REF_CLKN: U8.B28(PCIE30_PORT1_REF_CLKN) ; off-sheet PCIE30_PORT1_REF_CLKN
PCIE30_PORT1_REF_CLKP: U8.A28(PCIE30_PORT1_REF_CLKP) ; off-sheet PCIE30_PORT1_REF_CLKP
PCIE30_PORT1_RX0N: U8.A32(PCIE30_PORT1_RX0N) ; off-sheet PCIE30_PORT1_RX0N
PCIE30_PORT1_RX0P: U8.B32(PCIE30_PORT1_RX0P) ; off-sheet PCIE30_PORT1_RX0P
PCIE30_PORT1_RX1N: U8.B31(PCIE30_PORT1_RX1N) ; off-sheet PCIE30_PORT1_RX1N
PCIE30_PORT1_RX1P: U8.C31(PCIE30_PORT1_RX1P) ; off-sheet PCIE30_PORT1_RX1P
PCIE30_PORT1_TX0N: U8.A30(PCIE30_PORT1_TX0N) ; off-sheet PCIE30_PORT1_TX0N
PCIE30_PORT1_TX0P: U8.B30(PCIE30_PORT1_TX0P) ; off-sheet PCIE30_PORT1_TX0P
PCIE30_PORT1_TX1N: U8.B29(PCIE30_PORT1_TX1N) ; off-sheet PCIE30_PORT1_TX1N
PCIE30_PORT1_TX1P: U8.C29(PCIE30_PORT1_TX1P) ; off-sheet PCIE30_PORT1_TX1P
NetR72_1: R72.1 U8.B34(PCIE30_PORT0_RESREF)
NetR73_1: R73.1 U8.A33(PCIE30_PORT1_RESREF)

Not connected (* = marked no-connect by the designer): U8 G30(PCIE20_2_REFCLKN)* G31(PCIE20_2_REFCLKP)* H29(PCIE20_2_TXN/SATA30_2_TXN/USB30_2_SSTXN)* H30(PCIE20_2_TXP/SATA30_2_TXP/USB30_2_SSTXP)* J30(PCIE20_2_RXN/SATA30_2_RXN/USB30_2_SSRXN)* J31(PCIE20_2_RXP/SATA30_2_RXP/USB30_2_SSRXP)*

### Notes on the sheet
- RK3588 PCIE2.0
- RK3588 PCIE3.0
- (near U8) 连接底板SATA硬盘接口
- (near U8) 连接底板PCIE M2 M KEY接口
- (near C277) 放在主芯片背面
- (near C280) 放在主芯片背面
- (near U8) 放在主芯片背面
- (near C279) 放在主芯片旁边
- (near U8) 连接底板PCIE M2 E KEY接口
- (near C282) 放在主芯片旁边
- (near U8) 连接底板PCIE插槽
- (near C283) 放在主芯片背面
- (near C284) 放在主芯片背面
- (near C286) 放在主芯片旁边
- 放在主芯片背面
- (near C288) 放在主芯片旁边
- (in symbol SOC_RK3588, part N) PCIE20/SATA30 Mux0; input or output; PCIe20x1_2 / 1Lane(RC)--4(1L2); MUX; SATA30 HOST / Controller0; PCIE20:Gen1/Gen2 / SATA30:Gen1/Gen2/Gen3; PCIE20/SATA30 Mux1; PCIe30x1_0 / 1Lane(RC)--2(1L0); SATA30 HOST / Controller1; PCIE20/SATA30/USB30 HOST Mux2; PCIe30x1_1 / 1Lane(RC)--3(1L1); SATA30 HOST / Controller2; USB30 HOST / Controller2; PCIE20:Gen1/Gen2 / USB 30:Gen1 / SATA30:Gen1/Gen2/Gen3
- (in symbol SOC_RK3588, part O) PCIE30 PORT0 /; PCIE30X4; input; Lane0 /; PCIe30X4 / 4Lane(DM)--0(4L); Lane1 /; PCIe30x1_0 / 1Lane(RC)--2(1L0); PCIE20/SATA30 / MUX1; PCIE30: / PCIe1.1(2.5Gbps) / PCIe2.1(5Gbps) / PCIe3.0(8Gbps) /; PCIE30 PORT1 /; Lane0; PCIe30x2 / 2Lane(RC)--1(2L); PCIe30x1_1 / 1Lane(RC)--3(1L1); PCIE20/SATA30/USB30 / MUX2

### Library data of the parts
C277-C288 = C: 贴片电容/MLCC电容
R72 R73 = R: 贴片电阻
U8 = SOC_RK3588: ROCKCHIP SOC

## Sheet 14.RK3588_VCCIO4.SchDoc
size A4; SheetNumber: 14; SheetTotal: 21
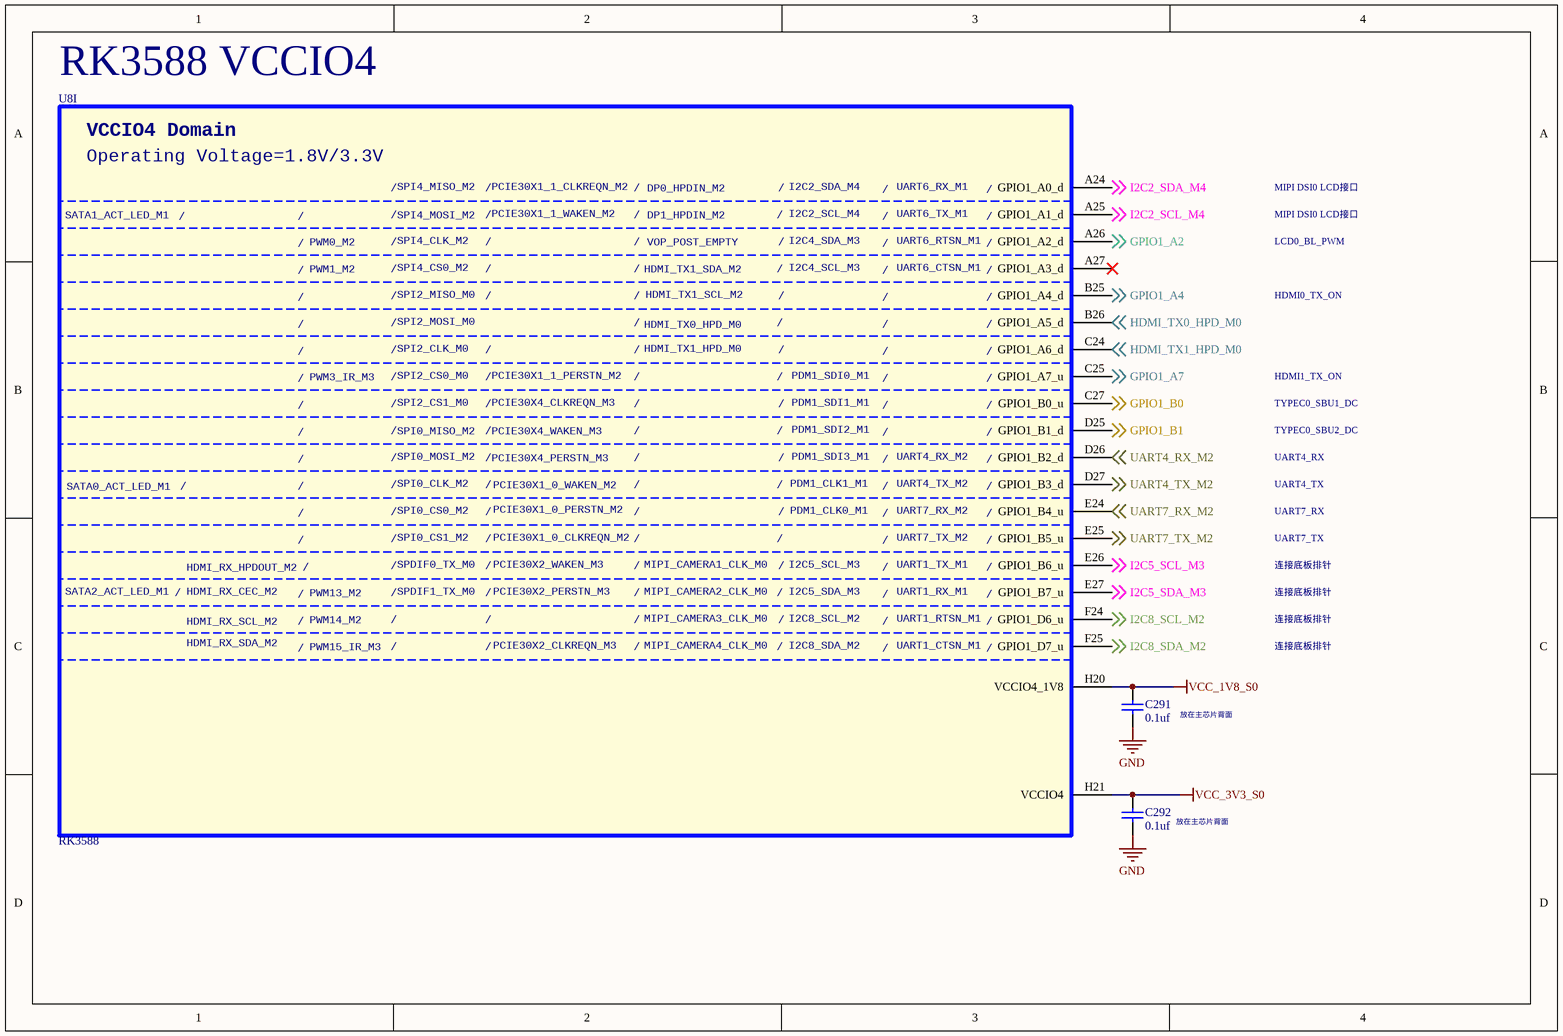
[diagram p13: 14.RK3588_VCCIO4.SchDoc]

### Parts
C291  0.1uf  [C0201_L]
C292  0.1uf  [C0201_L]
U8  RK3588  [BGA1088_23R00X23R00X2R00]  (part I of 26)

### Nets
GND: C291.1 C292.1
VCC_1V8_S0: C291.2 U8.H20(VCCIO4_1V8)
VCC_3V3_S0: C292.2 U8.H21(VCCIO4)
GPIO1_A2: U8.A26(GPIO1_A2_d) ; off-sheet GPIO1_A2
GPIO1_A4: U8.B25(GPIO1_A4_d) ; off-sheet GPIO1_A4
GPIO1_A7: U8.C25(GPIO1_A7_u) ; off-sheet GPIO1_A7
GPIO1_B0: U8.C27(GPIO1_B0_u) ; off-sheet GPIO1_B0
GPIO1_B1: U8.D25(GPIO1_B1_d) ; off-sheet GPIO1_B1
HDMI_TX0_HPD_M0: U8.B26(GPIO1_A5_d) ; off-sheet HDMI_TX0_HPD_M0
HDMI_TX1_HPD_M0: U8.C24(GPIO1_A6_d) ; off-sheet HDMI_TX1_HPD_M0
I2C2_SCL_M4: U8.A25(GPIO1_A1_d) ; off-sheet I2C2_SCL_M4
I2C2_SDA_M4: U8.A24(GPIO1_A0_d) ; off-sheet I2C2_SDA_M4
I2C5_SCL_M3: U8.E26(GPIO1_B6_u) ; off-sheet I2C5_SCL_M3
I2C5_SDA_M3: U8.E27(GPIO1_B7_u) ; off-sheet I2C5_SDA_M3
I2C8_SCL_M2: U8.F24(GPIO1_D6_u) ; off-sheet I2C8_SCL_M2
I2C8_SDA_M2: U8.F25(GPIO1_D7_u) ; off-sheet I2C8_SDA_M2
UART4_RX_M2: U8.D26(GPIO1_B2_d) ; off-sheet UART4_RX_M2
UART4_TX_M2: U8.D27(GPIO1_B3_d) ; off-sheet UART4_TX_M2
UART7_RX_M2: U8.E24(GPIO1_B4_u) ; off-sheet UART7_RX_M2
UART7_TX_M2: U8.E25(GPIO1_B5_u) ; off-sheet UART7_TX_M2

Not connected (* = marked no-connect by the designer): U8 A27(GPIO1_A3_d)*

### Notes on the sheet
- RK3588 VCCIO4
- MIPI DSI0 LCD接口
- LCD0_BL_PWM
- HDMI0_TX_ON
- HDMI1_TX_ON
- TYPEC0_SBU1_DC
- TYPEC0_SBU2_DC
- UART4_RX
- UART4_TX
- UART7_RX
- UART7_TX
- 连接底板排针
- (near C291) 放在主芯片背面
- (near C292) 放在主芯片背面
- (in symbol SOC_RK3588, part I) VCCIO4 Domain; Operating Voltage=1.8V/3.3V; /; SPI4_MISO_M2; PCIE30X1_1_CLKREQN_M2; DP0_HPDIN_M2; I2C2_SDA_M4; UART6_RX_M1; SATA1_ACT_LED_M1; SPI4_MOSI_M2; PCIE30X1_1_WAKEN_M2; DP1_HPDIN_M2; I2C2_SCL_M4; UART6_TX_M1; PWM0_M2; SPI4_CLK_M2; VOP_POST_EMPTY; I2C4_SDA_M3; UART6_RTSN_M1; PWM1_M2; SPI4_CS0_M2; HDMI_TX1_SDA_M2; I2C4_SCL_M3; UART6_CTSN_M1; SPI2_MISO_M0; HDMI_TX1_SCL_M2; SPI2_MOSI_M0; HDMI_TX0_HPD_M0; SPI2_CLK_M0; HDMI_TX1_HPD_M0; PWM3_IR_M3; SPI2_CS0_M0; PCIE30X1_1_PERSTN_M2; PDM1_SDI0_M1; SPI2_CS1_M0; PCIE30X4_CLKREQN_M3; PDM1_SDI1_M1; SPI0_MISO_M2; PCIE30X4_WAKEN_M3; PDM1_SDI2_M1; SPI0_MOSI_M2; PCIE30X4_PERSTN_M3; PDM1_SDI3_M1; UART4_RX_M2; SATA0_ACT_LED_M1; SPI0_CLK_M2; PCIE30X1_0_WAKEN_M2; PDM1_CLK1_M1; UART4_TX_M2; SPI0_CS0_M2; PCIE30X1_0_PERSTN_M2; PDM1_CLK0_M1; UART7_RX_M2; SPI0_CS1_M2; PCIE30X1_0_CLKREQN_M2; UART7_TX_M2; HDMI_RX_HPDOUT_M2; SPDIF0_TX_M0; PCIE30X2_WAKEN_M3; MIPI_CAMERA1_CLK_M0; I2C5_SCL_M3; UART1_TX_M1; SATA2_ACT_LED_M1; HDMI_RX_CEC_M2; PWM13_M2; SPDIF1_TX_M0; PCIE30X2_PERSTN_M3; MIPI_CAMERA2_CLK_M0; I2C5_SDA_M3; UART1_RX_M1; HDMI_RX_SCL_M2; PWM14_M2; MIPI_CAMERA3_CLK_M0; I2C8_SCL_M2; UART1_RTSN_M1; HDMI_RX_SDA_M2; PWM15_IR_M3; PCIE30X2_CLKREQN_M3; MIPI_CAMERA4_CLK_M0; I2C8_SDA_M2; UART1_CTSN_M1

### Library data of the parts
C291 C292 = C: 贴片电容/MLCC电容
U8 = SOC_RK3588: ROCKCHIP SOC

## Sheet 15.RK3588_VCCIO5.SchDoc
size A3; SheetNumber: 15; SheetTotal: 21
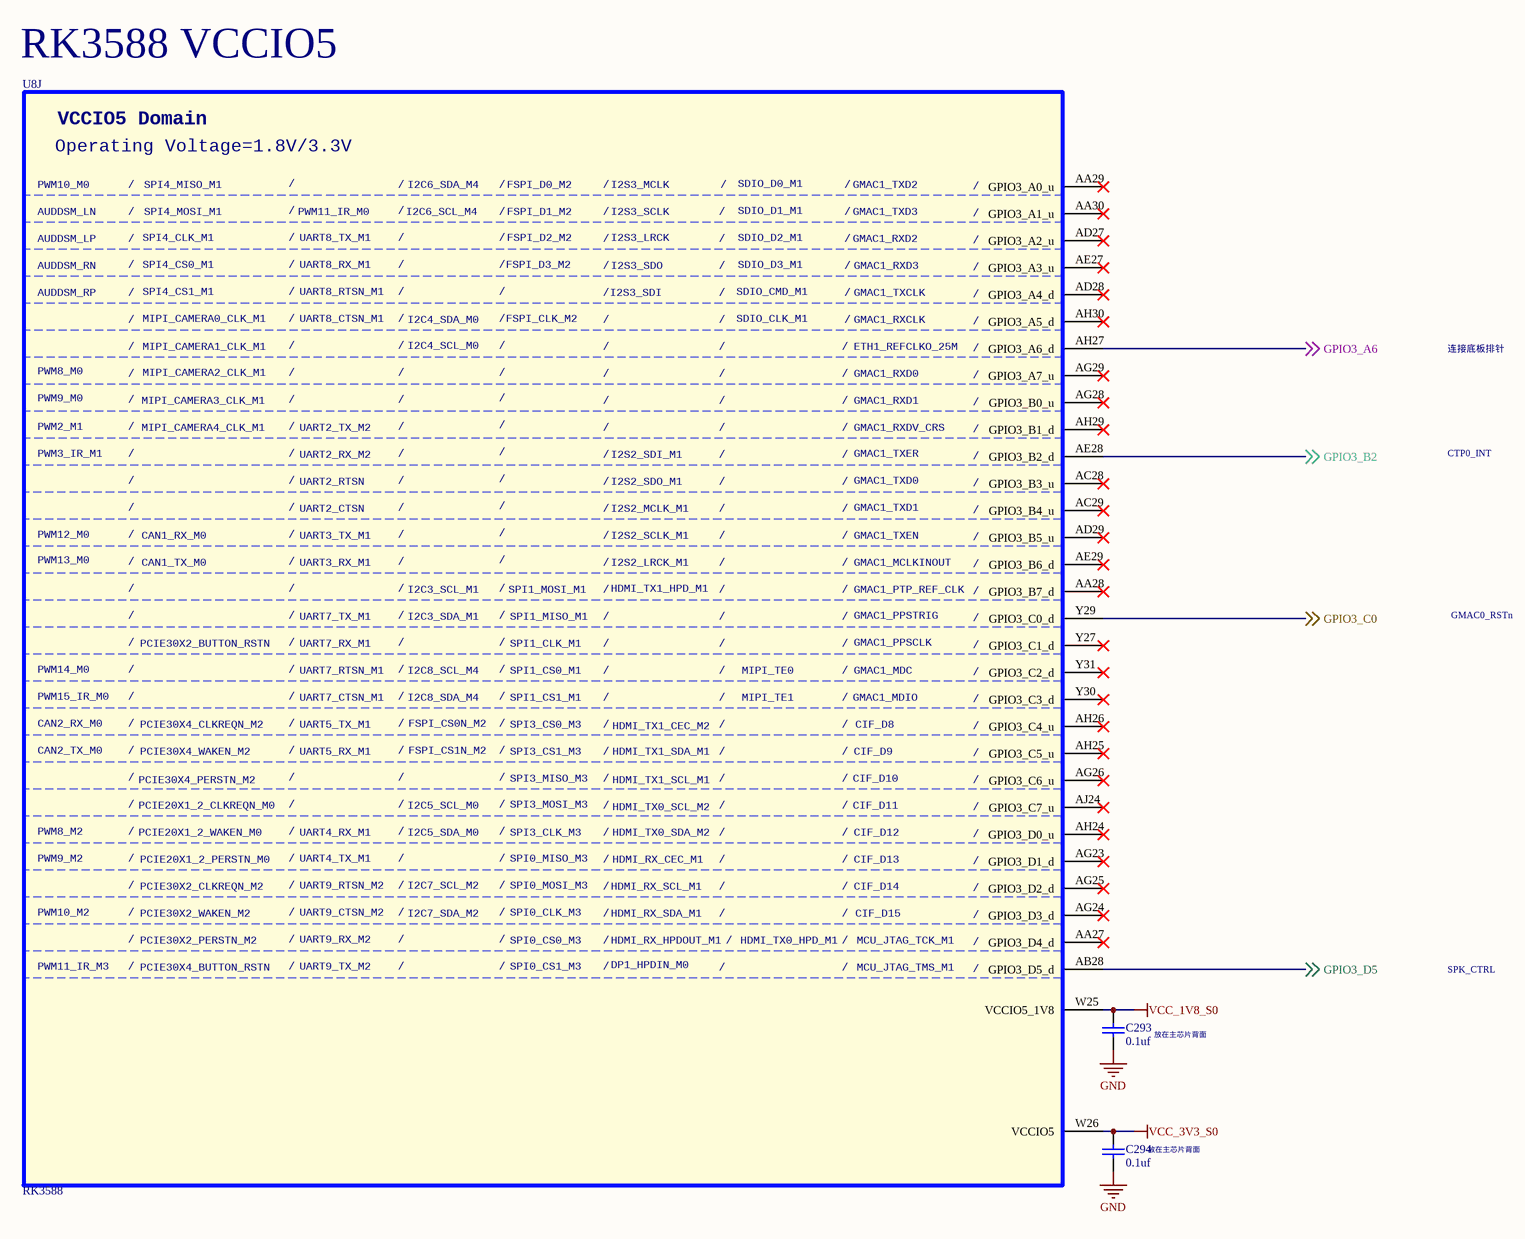
[diagram p14: 15.RK3588_VCCIO5.SchDoc]

### Parts
C293  0.1uf  [C0201_L]
C294  0.1uf  [C0201_L]
U8  RK3588  [BGA1088_23R00X23R00X2R00]  (part J of 26)

### Nets
GND: C293.1 C294.1
VCC_1V8_S0: C293.2 U8.W25(VCCIO5_1V8)
VCC_3V3_S0: C294.2 U8.W26(VCCIO5)
GPIO3_A6: U8.AH27(GPIO3_A6_d) ; off-sheet GPIO3_A6
GPIO3_B2: U8.AE28(GPIO3_B2_d) ; off-sheet GPIO3_B2
GPIO3_C0: U8.Y29(GPIO3_C0_d) ; off-sheet GPIO3_C0
GPIO3_D5: U8.AB28(GPIO3_D5_d) ; off-sheet GPIO3_D5

Not connected (* = marked no-connect by the designer): U8 AA27(GPIO3_D4_d)* AA28(GPIO3_B7_d)* AA29(GPIO3_A0_u)* AA30(GPIO3_A1_u)* AC28(GPIO3_B3_u)* AC29(GPIO3_B4_u)* AD27(GPIO3_A2_u)* AD28(GPIO3_A4_d)* AD29(GPIO3_B5_u)* AE27(GPIO3_A3_u)* AE29(GPIO3_B6_d)* AG23(GPIO3_D1_d)* AG24(GPIO3_D3_d)* AG25(GPIO3_D2_d)* AG26(GPIO3_C6_u)* AG28(GPIO3_B0_u)* AG29(GPIO3_A7_u)* AH24(GPIO3_D0_u)* AH25(GPIO3_C5_u)* AH26(GPIO3_C4_u)* AH29(GPIO3_B1_d)* AH30(GPIO3_A5_d)* AJ24(GPIO3_C7_u)* Y27(GPIO3_C1_d)* Y30(GPIO3_C3_d)* Y31(GPIO3_C2_d)*

### Notes on the sheet
- RK3588 VCCIO5
- 连接底板排针
- CTP0_INT
- GMAC0_RSTn
- SPK_CTRL
- (near C293) 放在主芯片背面
- (near C294) 放在主芯片背面
- (in symbol SOC_RK3588, part J) VCCIO5 Domain; Operating Voltage=1.8V/3.3V; PWM10_M0; /; SPI4_MISO_M1; I2C6_SDA_M4; FSPI_D0_M2; I2S3_MCLK; SDIO_D0_M1; GMAC1_TXD2; AUDDSM_LN; SPI4_MOSI_M1; PWM11_IR_M0; I2C6_SCL_M4; FSPI_D1_M2; I2S3_SCLK; SDIO_D1_M1; GMAC1_TXD3; AUDDSM_LP; SPI4_CLK_M1; UART8_TX_M1; FSPI_D2_M2; I2S3_LRCK; SDIO_D2_M1; GMAC1_RXD2; AUDDSM_RN; SPI4_CS0_M1; UART8_RX_M1; FSPI_D3_M2; I2S3_SDO; SDIO_D3_M1; GMAC1_RXD3; AUDDSM_RP; SPI4_CS1_M1; UART8_RTSN_M1; I2S3_SDI; SDIO_CMD_M1; GMAC1_TXCLK; MIPI_CAMERA0_CLK_M1; UART8_CTSN_M1; I2C4_SDA_M0; FSPI_CLK_M2; SDIO_CLK_M1; GMAC1_RXCLK; MIPI_CAMERA1_CLK_M1; I2C4_SCL_M0; ETH1_REFCLKO_25M; PWM8_M0; MIPI_CAMERA2_CLK_M1; GMAC1_RXD0; PWM9_M0; MIPI_CAMERA3_CLK_M1; GMAC1_RXD1; PWM2_M1; MIPI_CAMERA4_CLK_M1; UART2_TX_M2; GMAC1_RXDV_CRS; PWM3_IR_M1; UART2_RX_M2; I2S2_SDI_M1; GMAC1_TXER; UART2_RTSN; I2S2_SDO_M1; GMAC1_TXD0; UART2_CTSN; I2S2_MCLK_M1; GMAC1_TXD1; PWM12_M0; CAN1_RX_M0; UART3_TX_M1; I2S2_SCLK_M1; GMAC1_TXEN; PWM13_M0; CAN1_TX_M0; UART3_RX_M1; I2S2_LRCK_M1; GMAC1_MCLKINOUT; I2C3_SCL_M1; SPI1_MOSI_M1; HDMI_TX1_HPD_M1; GMAC1_PTP_REF_CLK; UART7_TX_M1; I2C3_SDA_M1; SPI1_MISO_M1; GMAC1_PPSTRIG; PCIE30X2_BUTTON_RSTN; UART7_RX_M1; SPI1_CLK_M1; GMAC1_PPSCLK; PWM14_M0; UART7_RTSN_M1; I2C8_SCL_M4; SPI1_CS0_M1; MIPI_TE0; GMAC1_MDC; PWM15_IR_M0; UART7_CTSN_M1; I2C8_SDA_M4; SPI1_CS1_M1; MIPI_TE1; GMAC1_MDIO; CAN2_RX_M0; PCIE30X4_CLKREQN_M2; UART5_TX_M1; FSPI_CS0N_M2; SPI3_CS0_M3; HDMI_TX1_CEC_M2; CIF_D8; CAN2_TX_M0; PCIE30X4_WAKEN_M2; UART5_RX_M1; FSPI_CS1N_M2; SPI3_CS1_M3; HDMI_TX1_SDA_M1; CIF_D9; PCIE30X4_PERSTN_M2; SPI3_MISO_M3; HDMI_TX1_SCL_M1; CIF_D10; PCIE20X1_2_CLKREQN_M0; I2C5_SCL_M0; SPI3_MOSI_M3; HDMI_TX0_SCL_M2; CIF_D11; PWM8_M2; PCIE20X1_2_WAKEN_M0; UART4_RX_M1; I2C5_SDA_M0; SPI3_CLK_M3; HDMI_TX0_SDA_M2; CIF_D12; PWM9_M2; PCIE20X1_2_PERSTN_M0; UART4_TX_M1; SPI0_MISO_M3; HDMI_RX_CEC_M1; CIF_D13; PCIE30X2_CLKREQN_M2; UART9_RTSN_M2; I2C7_SCL_M2; SPI0_MOSI_M3; HDMI_RX_SCL_M1; CIF_D14; PWM10_M2; PCIE30X2_WAKEN_M2; UART9_CTSN_M2; I2C7_SDA_M2; SPI0_CLK_M3; HDMI_RX_SDA_M1; CIF_D15; PCIE30X2_PERSTN_M2; UART9_RX_M2; SPI0_CS0_M3; HDMI_RX_HPDOUT_M1; HDMI_TX0_HPD_M1; MCU_JTAG_TCK_M1; DP1_HPDIN_M0; PWM11_IR_M3; PCIE30X4_BUTTON_RSTN; UART9_TX_M2; SPI0_CS1_M3; MCU_JTAG_TMS_M1

### Library data of the parts
C293 C294 = C: 贴片电容/MLCC电容
U8 = SOC_RK3588: ROCKCHIP SOC

## Sheet 16.RK3588_VCCIO6.SchDoc
size A4; SheetNumber: 16; SheetTotal: 21
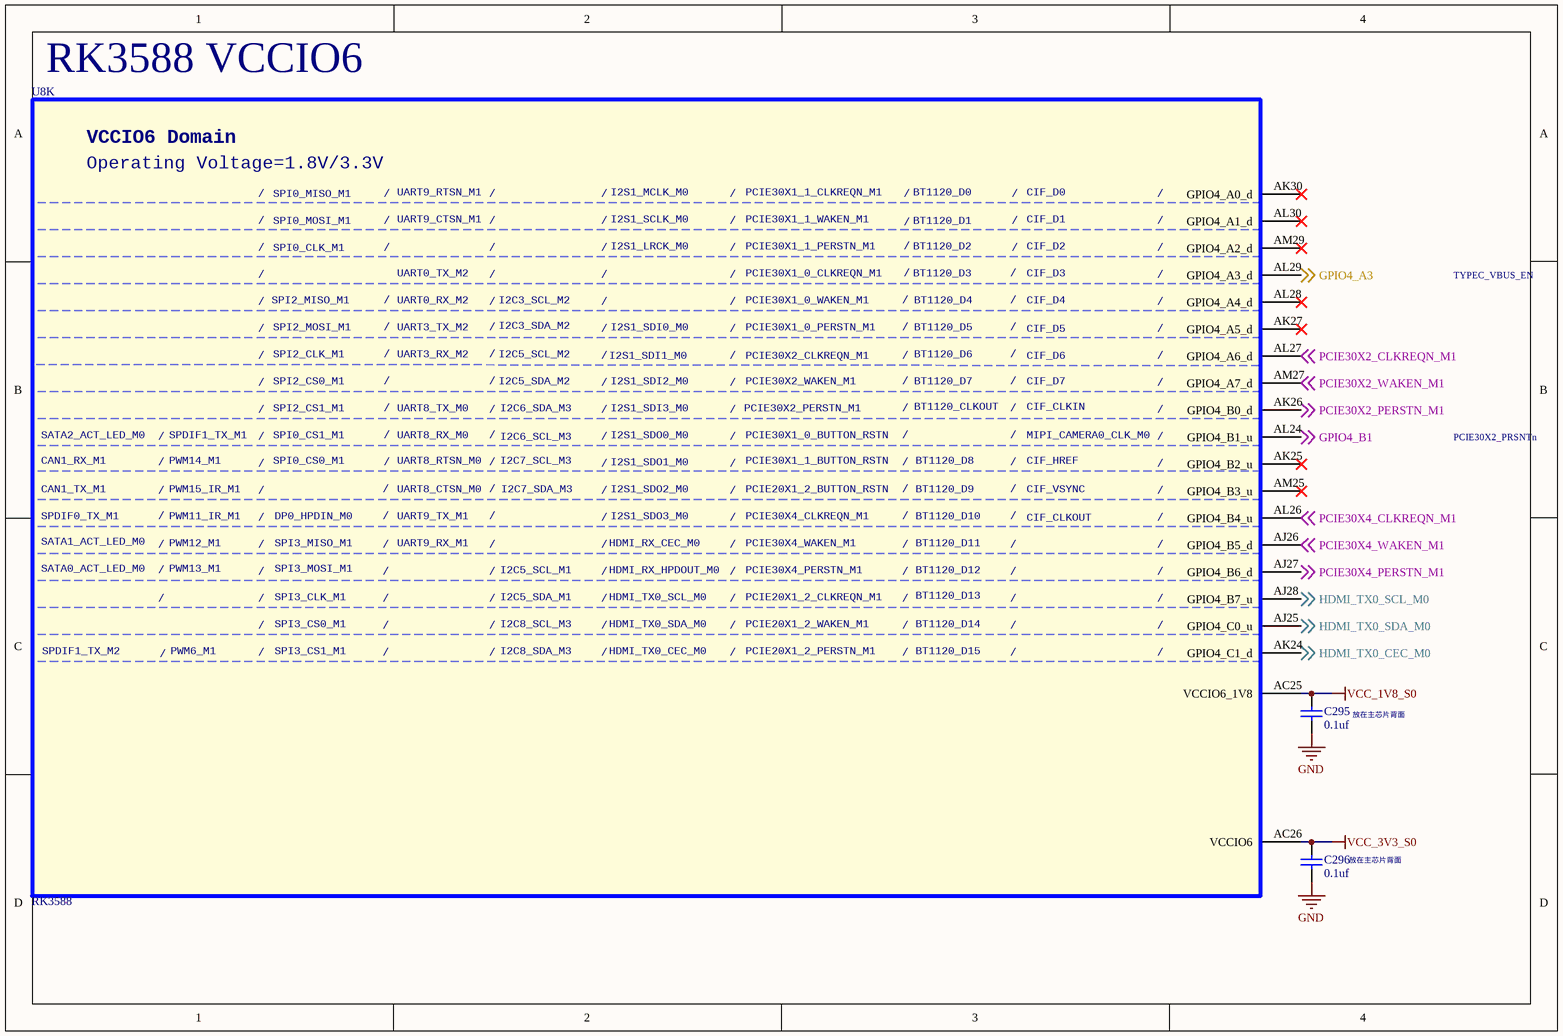
[diagram p15: 16.RK3588_VCCIO6.SchDoc]

### Parts
C295  0.1uf  [C0201_L]
C296  0.1uf  [C0201_L]
U8  RK3588  [BGA1088_23R00X23R00X2R00]  (part K of 26)

### Nets
GND: C295.1 C296.1
VCC_1V8_S0: C295.2 U8.AC25(VCCIO6_1V8)
VCC_3V3_S0: C296.2 U8.AC26(VCCIO6)
GPIO4_A3: U8.AL29(GPIO4_A3_d) ; off-sheet GPIO4_A3
GPIO4_B1: U8.AL24(GPIO4_B1_u) ; off-sheet GPIO4_B1
HDMI_TX0_CEC_M0: U8.AK24(GPIO4_C1_d) ; off-sheet HDMI_TX0_CEC_M0
HDMI_TX0_SCL_M0: U8.AJ28(GPIO4_B7_u) ; off-sheet HDMI_TX0_SCL_M0
HDMI_TX0_SDA_M0: U8.AJ25(GPIO4_C0_u) ; off-sheet HDMI_TX0_SDA_M0
PCIE30X2_CLKREQN_M1: U8.AL27(GPIO4_A6_d) ; off-sheet PCIE30X2_CLKREQN_M1
PCIE30X2_PERSTN_M1: U8.AK26(GPIO4_B0_d) ; off-sheet PCIE30X2_PERSTN_M1
PCIE30X2_WAKEN_M1: U8.AM27(GPIO4_A7_d) ; off-sheet PCIE30X2_WAKEN_M1
PCIE30X4_CLKREQN_M1: U8.AL26(GPIO4_B4_u) ; off-sheet PCIE30X4_CLKREQN_M1
PCIE30X4_PERSTN_M1: U8.AJ27(GPIO4_B6_d) ; off-sheet PCIE30X4_PERSTN_M1
PCIE30X4_WAKEN_M1: U8.AJ26(GPIO4_B5_d) ; off-sheet PCIE30X4_WAKEN_M1

Not connected (* = marked no-connect by the designer): U8 AK25(GPIO4_B2_u)* AK27(GPIO4_A5_d)* AK30(GPIO4_A0_d)* AL28(GPIO4_A4_d)* AL30(GPIO4_A1_d)* AM25(GPIO4_B3_u)* AM29(GPIO4_A2_d)*

### Notes on the sheet
- RK3588 VCCIO6
- TYPEC_VBUS_EN
- PCIE30X2_PRSNTn
- (near C295) 放在主芯片背面
- (near C296) 放在主芯片背面
- (in symbol SOC_RK3588, part K) VCCIO6 Domain; Operating Voltage=1.8V/3.3V; /; SPI0_MISO_M1; UART9_RTSN_M1; I2S1_MCLK_M0; PCIE30X1_1_CLKREQN_M1; BT1120_D0; CIF_D0; SPI0_MOSI_M1; UART9_CTSN_M1; I2S1_SCLK_M0; PCIE30X1_1_WAKEN_M1; BT1120_D1; CIF_D1; SPI0_CLK_M1; I2S1_LRCK_M0; PCIE30X1_1_PERSTN_M1; BT1120_D2; CIF_D2; UART0_TX_M2; PCIE30X1_0_CLKREQN_M1; BT1120_D3; CIF_D3; SPI2_MISO_M1; UART0_RX_M2; I2C3_SCL_M2; PCIE30X1_0_WAKEN_M1; BT1120_D4; CIF_D4; SPI2_MOSI_M1; UART3_TX_M2; I2C3_SDA_M2; I2S1_SDI0_M0; PCIE30X1_0_PERSTN_M1; BT1120_D5; CIF_D5; SPI2_CLK_M1; UART3_RX_M2; I2C5_SCL_M2; I2S1_SDI1_M0; PCIE30X2_CLKREQN_M1; BT1120_D6; CIF_D6; SPI2_CS0_M1; I2C5_SDA_M2; I2S1_SDI2_M0; PCIE30X2_WAKEN_M1; BT1120_D7; CIF_D7; SPI2_CS1_M1; UART8_TX_M0; I2C6_SDA_M3; I2S1_SDI3_M0; PCIE30X2_PERSTN_M1; BT1120_CLKOUT; CIF_CLKIN; SATA2_ACT_LED_M0; SPDIF1_TX_M1; SPI0_CS1_M1; UART8_RX_M0; I2C6_SCL_M3; I2S1_SDO0_M0; PCIE30X1_0_BUTTON_RSTN; MIPI_CAMERA0_CLK_M0; CAN1_RX_M1; PWM14_M1; SPI0_CS0_M1; UART8_RTSN_M0; I2C7_SCL_M3; I2S1_SDO1_M0; PCIE30X1_1_BUTTON_RSTN; BT1120_D8; CIF_HREF; CAN1_TX_M1; PWM15_IR_M1; UART8_CTSN_M0; I2C7_SDA_M3; I2S1_SDO2_M0; PCIE20X1_2_BUTTON_RSTN; BT1120_D9; CIF_VSYNC; SPDIF0_TX_M1; PWM11_IR_M1; DP0_HPDIN_M0; UART9_TX_M1; I2S1_SDO3_M0; PCIE30X4_CLKREQN_M1; BT1120_D10; CIF_CLKOUT; SATA1_ACT_LED_M0; PWM12_M1; SPI3_MISO_M1; UART9_RX_M1; HDMI_RX_CEC_M0; PCIE30X4_WAKEN_M1; BT1120_D11; SATA0_ACT_LED_M0; PWM13_M1; SPI3_MOSI_M1; I2C5_SCL_M1; HDMI_RX_HPDOUT_M0; PCIE30X4_PERSTN_M1; BT1120_D12; SPI3_CLK_M1; I2C5_SDA_M1; HDMI_TX0_SCL_M0; PCIE20X1_2_CLKREQN_M1; BT1120_D13; SPI3_CS0_M1; I2C8_SCL_M3; HDMI_TX0_SDA_M0; PCIE20X1_2_WAKEN_M1; BT1120_D14; SPDIF1_TX_M2; PWM6_M1; SPI3_CS1_M1; I2C8_SDA_M3; HDMI_TX0_CEC_M0; PCIE20X1_2_PERSTN_M1; BT1120_D15

### Library data of the parts
C295 C296 = C: 贴片电容/MLCC电容
U8 = SOC_RK3588: ROCKCHIP SOC

## Sheet 17.LPDDR4_LPDDR4x_1.SchDoc
size A4; SheetNumber: 17; SheetTotal: 21
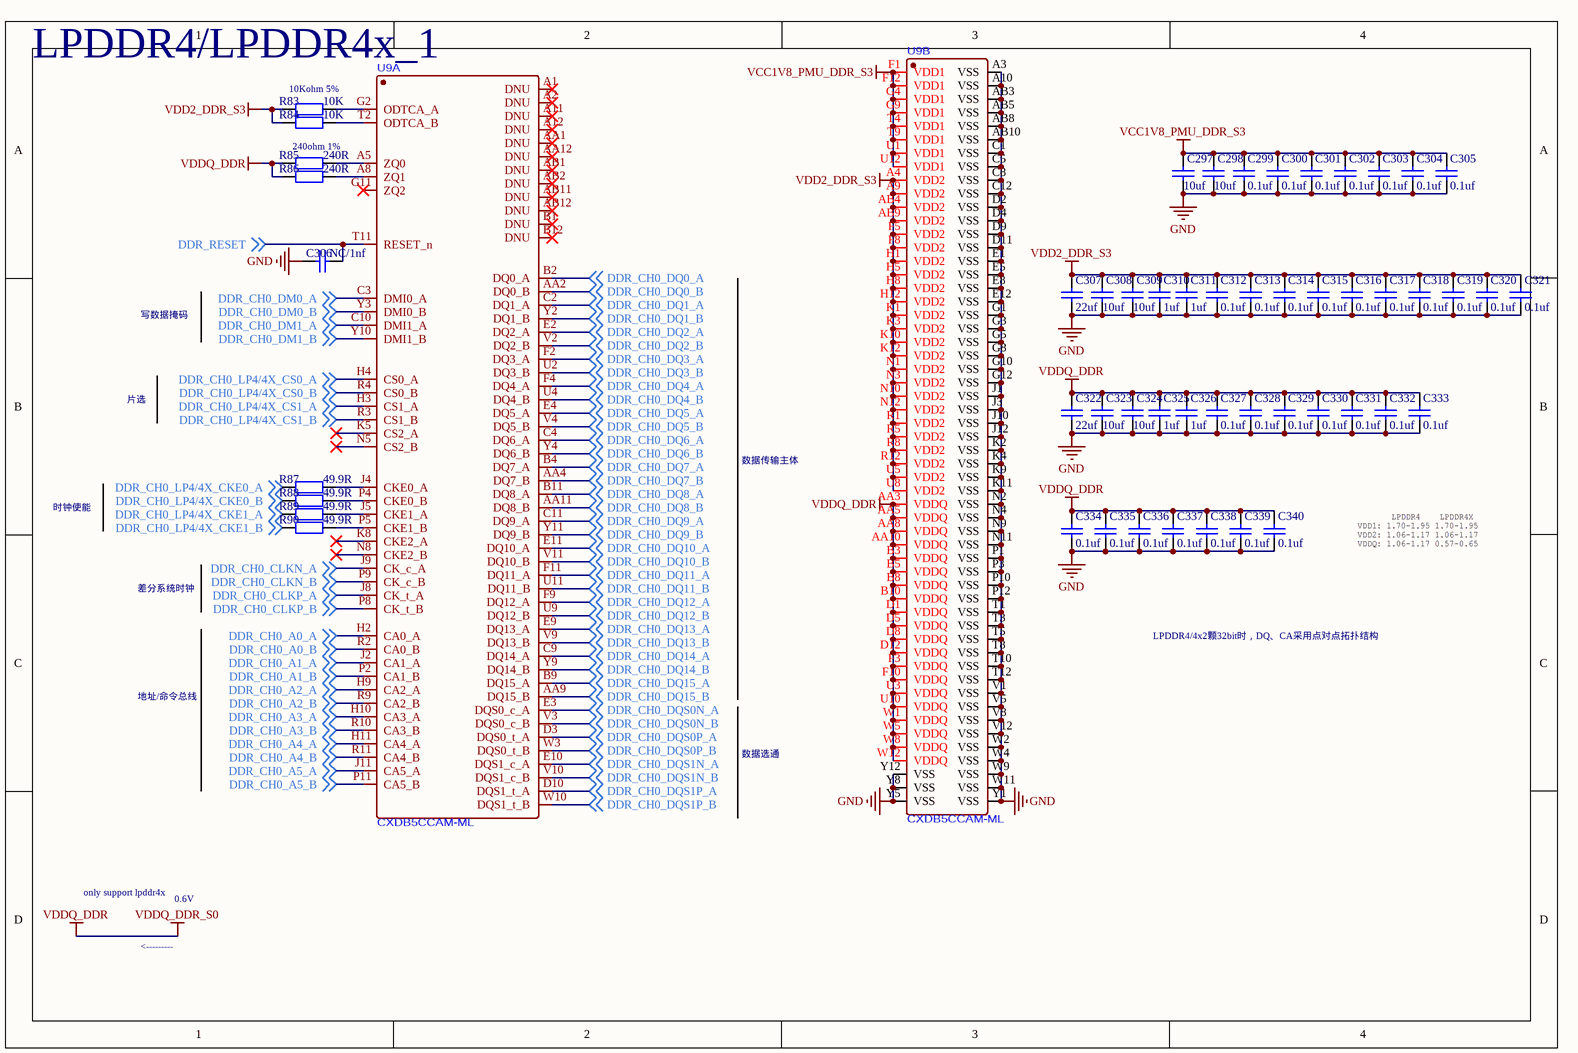
[diagram p16: 17.LPDDR4_LPDDR4x_1.SchDoc]

### Parts
C297  10uf  [C0402_L]
C298  10uf  [C0402_L]
C299  0.1uf  [C0201_L]
C300  0.1uf  [C0201_L]
C301  0.1uf  [C0201_L]
C302  0.1uf  [C0201_L]
C303  0.1uf  [C0201_L]
C304  0.1uf  [C0201_L]
C305  0.1uf  [C0201_L]
C306  NC/1nf  [C0201_L]
C307  22uf  [C0603_L]
C308  10uf  [C0402_L]
C309  10uf  [C0402_L]
C310  1uf  [C0201_L]
C311  1uf  [C0201_L]
C312  0.1uf  [C0201_L]
C313  0.1uf  [C0201_L]
C314  0.1uf  [C0201_L]
C315  0.1uf  [C0201_L]
C316  0.1uf  [C0201_L]
C317  0.1uf  [C0201_L]
C318  0.1uf  [C0201_L]
C319  0.1uf  [C0201_L]
C320  0.1uf  [C0201_L]
C321  0.1uf  [C0201_L]
C322  22uf  [C0603_L]
C323  10uf  [C0402_L]
C324  10uf  [C0402_L]
C325  1uf  [C0201_L]
C326  1uf  [C0201_L]
C327  0.1uf  [C0201_L]
C328  0.1uf  [C0201_L]
C329  0.1uf  [C0201_L]
C330  0.1uf  [C0201_L]
C331  0.1uf  [C0201_L]
C332  0.1uf  [C0201_L]
C333  0.1uf  [C0201_L]
C334  0.1uf  [C0201_L]
C335  0.1uf  [C0201_L]
C336  0.1uf  [C0201_L]
C337  0.1uf  [C0201_L]
C338  0.1uf  [C0201_L]
C339  0.1uf  [C0201_L]
C340  0.1uf  [C0201_L]
R83  10K  [R0201_L]
R84  10K  [R0201_L]
R85  240R  [R0201_L]
R86  240R  [R0201_L]
R87  49.9R  [R0201_L]
R88  49.9R  [R0201_L]
R89  49.9R  [R0201_L]
R90  49.9R  [R0201_L]
U9  CXDB5CCAM-ML  [FBGA-200_L15.0-W10.0-BL_K4F6E3S4HM]  (parts A,B of 2)

### Nets
GND: C297.1 C298.1 C299.1 C300.1 C301.1 C302.1 C303.1 C304.1 C305.1 C306.1 C307.1 C308.1 C309.1 C310.1 C311.1 C312.1 C313.1 C314.1 C315.1 C316.1 C317.1 C318.1 C319.1 C320.1 C321.1 C322.1 C323.1 C324.1 C325.1 C326.1 C327.1 C328.1 C329.1 C330.1 C331.1 C332.1 C333.1 C334.1 C335.1 C336.1 C337.1 C338.1 C339.1 C340.1 U9.A3(VSS) U9.A10(VSS) U9.AB3(VSS) U9.AB5(VSS) U9.AB8(VSS) U9.AB10(VSS) U9.C1(VSS) U9.C5(VSS) U9.C8(VSS) U9.C12(VSS) U9.D2(VSS) U9.D4(VSS) U9.D9(VSS) U9.D11(VSS) U9.E1(VSS) U9.E5(VSS) U9.E8(VSS) U9.E12(VSS) U9.G1(VSS) U9.G3(VSS) U9.G5(VSS) U9.G8(VSS) U9.G10(VSS) U9.G12(VSS) U9.J1(VSS) U9.J3(VSS) U9.J10(VSS) U9.J12(VSS) U9.K2(VSS) U9.K4(VSS) U9.K9(VSS) U9.K11(VSS) U9.N2(VSS) U9.N4(VSS) U9.N9(VSS) U9.N11(VSS) U9.P1(VSS) U9.P3(VSS) U9.P10(VSS) U9.P12(VSS) U9.T1(VSS) U9.T3(VSS) U9.T5(VSS) U9.T8(VSS) U9.T10(VSS) U9.T12(VSS) U9.V1(VSS) U9.V5(VSS) U9.V8(VSS) U9.V12(VSS) U9.W2(VSS) U9.W4(VSS) U9.W9(VSS) U9.W11(VSS) U9.Y1(VSS) U9.Y5(VSS) U9.Y8(VSS) U9.Y12(VSS)
VCC1V8_PMU_DDR_S3: C297.2 C298.2 C299.2 C300.2 C301.2 C302.2 C303.2 C304.2 C305.2 U9.F1(VDD1) U9.F12(VDD1) U9.G4(VDD1) U9.G9(VDD1) U9.T4(VDD1) U9.T9(VDD1) U9.U1(VDD1) U9.U12(VDD1)
VDD2_DDR_S3: C307.2 C308.2 C309.2 C310.2 C311.2 C312.2 C313.2 C314.2 C315.2 C316.2 C317.2 C318.2 C319.2 C320.2 C321.2 R83.1 R84.1 U9.A4(VDD2) U9.A9(VDD2) U9.AB4(VDD2) U9.AB9(VDD2) U9.F5(VDD2) U9.F8(VDD2) U9.H1(VDD2) U9.H5(VDD2) U9.H8(VDD2) U9.H12(VDD2) U9.K1(VDD2) U9.K3(VDD2) U9.K10(VDD2) U9.K12(VDD2) U9.N1(VDD2) U9.N3(VDD2) U9.N10(VDD2) U9.N12(VDD2) U9.R1(VDD2) U9.R5(VDD2) U9.R8(VDD2) U9.R12(VDD2) U9.U5(VDD2) U9.U8(VDD2)
VDDQ_DDR: C322.2 C323.2 C324.2 C325.2 C326.2 C327.2 C328.2 C329.2 C330.2 C331.2 C332.2 C333.2 C334.2 C335.2 C336.2 C337.2 C338.2 C339.2 C340.2 R85.1 R86.1 U9.AA3(VDDQ) U9.AA5(VDDQ) U9.AA8(VDDQ) U9.AA10(VDDQ) U9.B3(VDDQ) U9.B5(VDDQ) U9.B8(VDDQ) U9.B10(VDDQ) U9.D1(VDDQ) U9.D5(VDDQ) U9.D8(VDDQ) U9.D12(VDDQ) U9.F3(VDDQ) U9.F10(VDDQ) U9.U3(VDDQ) U9.U10(VDDQ) U9.W1(VDDQ) U9.W5(VDDQ) U9.W8(VDDQ) U9.W12(VDDQ)  [also labelled VDDQ_DDR_S0]
DDR_CH0_A0_A: U9.H2(CA0_A) ; off-sheet DDR_CH0_A0_A
DDR_CH0_A0_B: U9.R2(CA0_B) ; off-sheet DDR_CH0_A0_B
DDR_CH0_A1_A: U9.J2(CA1_A) ; off-sheet DDR_CH0_A1_A
DDR_CH0_A1_B: U9.P2(CA1_B) ; off-sheet DDR_CH0_A1_B
DDR_CH0_A2_A: U9.H9(CA2_A) ; off-sheet DDR_CH0_A2_A
DDR_CH0_A2_B: U9.R9(CA2_B) ; off-sheet DDR_CH0_A2_B
DDR_CH0_A3_A: U9.H10(CA3_A) ; off-sheet DDR_CH0_A3_A
DDR_CH0_A3_B: U9.R10(CA3_B) ; off-sheet DDR_CH0_A3_B
DDR_CH0_A4_A: U9.H11(CA4_A) ; off-sheet DDR_CH0_A4_A
DDR_CH0_A4_B: U9.R11(CA4_B) ; off-sheet DDR_CH0_A4_B
DDR_CH0_A5_A: U9.J11(CA5_A) ; off-sheet DDR_CH0_A5_A
DDR_CH0_A5_B: U9.P11(CA5_B) ; off-sheet DDR_CH0_A5_B
DDR_CH0_CLKN_A: U9.J9(CK_c_A) ; off-sheet DDR_CH0_CLKN_A
DDR_CH0_CLKN_B: U9.P9(CK_c_B) ; off-sheet DDR_CH0_CLKN_B
DDR_CH0_CLKP_A: U9.J8(CK_t_A) ; off-sheet DDR_CH0_CLKP_A
DDR_CH0_CLKP_B: U9.P8(CK_t_B) ; off-sheet DDR_CH0_CLKP_B
DDR_CH0_DM0_A: U9.C3(DMI0_A) ; off-sheet DDR_CH0_DM0_A
DDR_CH0_DM0_B: U9.Y3(DMI0_B) ; off-sheet DDR_CH0_DM0_B
DDR_CH0_DM1_A: U9.C10(DMI1_A) ; off-sheet DDR_CH0_DM1_A
DDR_CH0_DM1_B: U9.Y10(DMI1_B) ; off-sheet DDR_CH0_DM1_B
DDR_CH0_DQ0_A: U9.B2(DQ0_A) ; off-sheet DDR_CH0_DQ0_A
DDR_CH0_DQ0_B: U9.AA2(DQ0_B) ; off-sheet DDR_CH0_DQ0_B
DDR_CH0_DQ1_A: U9.C2(DQ1_A) ; off-sheet DDR_CH0_DQ1_A
DDR_CH0_DQ1_B: U9.Y2(DQ1_B) ; off-sheet DDR_CH0_DQ1_B
DDR_CH0_DQ2_A: U9.E2(DQ2_A) ; off-sheet DDR_CH0_DQ2_A
DDR_CH0_DQ2_B: U9.V2(DQ2_B) ; off-sheet DDR_CH0_DQ2_B
DDR_CH0_DQ3_A: U9.F2(DQ3_A) ; off-sheet DDR_CH0_DQ3_A
DDR_CH0_DQ3_B: U9.U2(DQ3_B) ; off-sheet DDR_CH0_DQ3_B
DDR_CH0_DQ4_A: U9.F4(DQ4_A) ; off-sheet DDR_CH0_DQ4_A
DDR_CH0_DQ4_B: U9.U4(DQ4_B) ; off-sheet DDR_CH0_DQ4_B
DDR_CH0_DQ5_A: U9.E4(DQ5_A) ; off-sheet DDR_CH0_DQ5_A
DDR_CH0_DQ5_B: U9.V4(DQ5_B) ; off-sheet DDR_CH0_DQ5_B
DDR_CH0_DQ6_A: U9.C4(DQ6_A) ; off-sheet DDR_CH0_DQ6_A
DDR_CH0_DQ6_B: U9.Y4(DQ6_B) ; off-sheet DDR_CH0_DQ6_B
DDR_CH0_DQ7_A: U9.B4(DQ7_A) ; off-sheet DDR_CH0_DQ7_A
DDR_CH0_DQ7_B: U9.AA4(DQ7_B) ; off-sheet DDR_CH0_DQ7_B
DDR_CH0_DQ8_A: U9.B11(DQ8_A) ; off-sheet DDR_CH0_DQ8_A
DDR_CH0_DQ8_B: U9.AA11(DQ8_B) ; off-sheet DDR_CH0_DQ8_B
DDR_CH0_DQ9_A: U9.C11(DQ9_A) ; off-sheet DDR_CH0_DQ9_A
DDR_CH0_DQ9_B: U9.Y11(DQ9_B) ; off-sheet DDR_CH0_DQ9_B
DDR_CH0_DQ10_A: U9.E11(DQ10_A) ; off-sheet DDR_CH0_DQ10_A
DDR_CH0_DQ10_B: U9.V11(DQ10_B) ; off-sheet DDR_CH0_DQ10_B
DDR_CH0_DQ11_A: U9.F11(DQ11_A) ; off-sheet DDR_CH0_DQ11_A
DDR_CH0_DQ11_B: U9.U11(DQ11_B) ; off-sheet DDR_CH0_DQ11_B
DDR_CH0_DQ12_A: U9.F9(DQ12_A) ; off-sheet DDR_CH0_DQ12_A
DDR_CH0_DQ12_B: U9.U9(DQ12_B) ; off-sheet DDR_CH0_DQ12_B
DDR_CH0_DQ13_A: U9.E9(DQ13_A) ; off-sheet DDR_CH0_DQ13_A
DDR_CH0_DQ13_B: U9.V9(DQ13_B) ; off-sheet DDR_CH0_DQ13_B
DDR_CH0_DQ14_A: U9.C9(DQ14_A) ; off-sheet DDR_CH0_DQ14_A
DDR_CH0_DQ14_B: U9.Y9(DQ14_B) ; off-sheet DDR_CH0_DQ14_B
DDR_CH0_DQ15_A: U9.B9(DQ15_A) ; off-sheet DDR_CH0_DQ15_A
DDR_CH0_DQ15_B: U9.AA9(DQ15_B) ; off-sheet DDR_CH0_DQ15_B
DDR_CH0_DQS0N_A: U9.E3(DQS0_c_A) ; off-sheet DDR_CH0_DQS0N_A
DDR_CH0_DQS0N_B: U9.V3(DQS0_c_B) ; off-sheet DDR_CH0_DQS0N_B
DDR_CH0_DQS0P_A: U9.D3(DQS0_t_A) ; off-sheet DDR_CH0_DQS0P_A
DDR_CH0_DQS0P_B: U9.W3(DQS0_t_B) ; off-sheet DDR_CH0_DQS0P_B
DDR_CH0_DQS1N_A: U9.E10(DQS1_c_A) ; off-sheet DDR_CH0_DQS1N_A
DDR_CH0_DQS1N_B: U9.V10(DQS1_c_B) ; off-sheet DDR_CH0_DQS1N_B
DDR_CH0_DQS1P_A: U9.D10(DQS1_t_A) ; off-sheet DDR_CH0_DQS1P_A
DDR_CH0_DQS1P_B: U9.W10(DQS1_t_B) ; off-sheet DDR_CH0_DQS1P_B
DDR_CH0_LP4/4X_CKE0_A: R87.1 ; off-sheet DDR_CH0_LP4/4X_CKE0_A
DDR_CH0_LP4/4X_CKE0_B: R88.1 ; off-sheet DDR_CH0_LP4/4X_CKE0_B
DDR_CH0_LP4/4X_CKE1_A: R89.1 ; off-sheet DDR_CH0_LP4/4X_CKE1_A
DDR_CH0_LP4/4X_CKE1_B: R90.1 ; off-sheet DDR_CH0_LP4/4X_CKE1_B
DDR_CH0_LP4/4X_CS0_A: U9.H4(CS0_A) ; off-sheet DDR_CH0_LP4/4X_CS0_A
DDR_CH0_LP4/4X_CS0_B: U9.R4(CS0_B) ; off-sheet DDR_CH0_LP4/4X_CS0_B
DDR_CH0_LP4/4X_CS1_A: U9.H3(CS1_A) ; off-sheet DDR_CH0_LP4/4X_CS1_A
DDR_CH0_LP4/4X_CS1_B: U9.R3(CS1_B) ; off-sheet DDR_CH0_LP4/4X_CS1_B
DDR_RESET: C306.2 U9.T11(RESET_n) ; off-sheet DDR_RESET
NetR83_2: R83.2 U9.G2(ODTCA_A)
NetR84_2: R84.2 U9.T2(ODTCA_B)
NetR85_2: R85.2 U9.A5(ZQ0)
NetR86_2: R86.2 U9.A8(ZQ1)
NetR87_2: R87.2 U9.J4(CKE0_A)
NetR88_2: R88.2 U9.P4(CKE0_B)
NetR89_2: R89.2 U9.J5(CKE1_A)
NetR90_2: R90.2 U9.P5(CKE1_B)

Not connected (* = marked no-connect by the designer): U9 A1(DNU)* A2(DNU)* A11(DNU)* A12(DNU)* AA1(DNU)* AA12(DNU)* AB1(DNU)* AB2(DNU)* AB11(DNU)* AB12(DNU)* B1(DNU)* B12(DNU)* G11(ZQ2)* K5(CS2_A)* K8(CKE2_A)* N5(CS2_B)* N8(CKE2_B)*

### Notes on the sheet
- (near U9) LPDDR4/LPDDR4x_1
- (near R83) 10Kohm 5%
- (near R85) 240ohm 1%
- 写数据掩码
- 片选
- 数据传输主体
- 时钟使能
- 差分系统时钟
- LPDDR4/4x2颗32bit时，DQ、CA采用点对点拓扑结构
- 地址/命令总线
- 数据选通
- only support lpddr4x
- 0.6V
- <---------

### Library data of the parts
C297-C340 = C: 贴片电容/MLCC电容
R83-R90 = R: 贴片电阻

## Sheet 18.LPDDR4_LPDDR4x_2.SchDoc
size A4; SheetNumber: 18; SheetTotal: 21
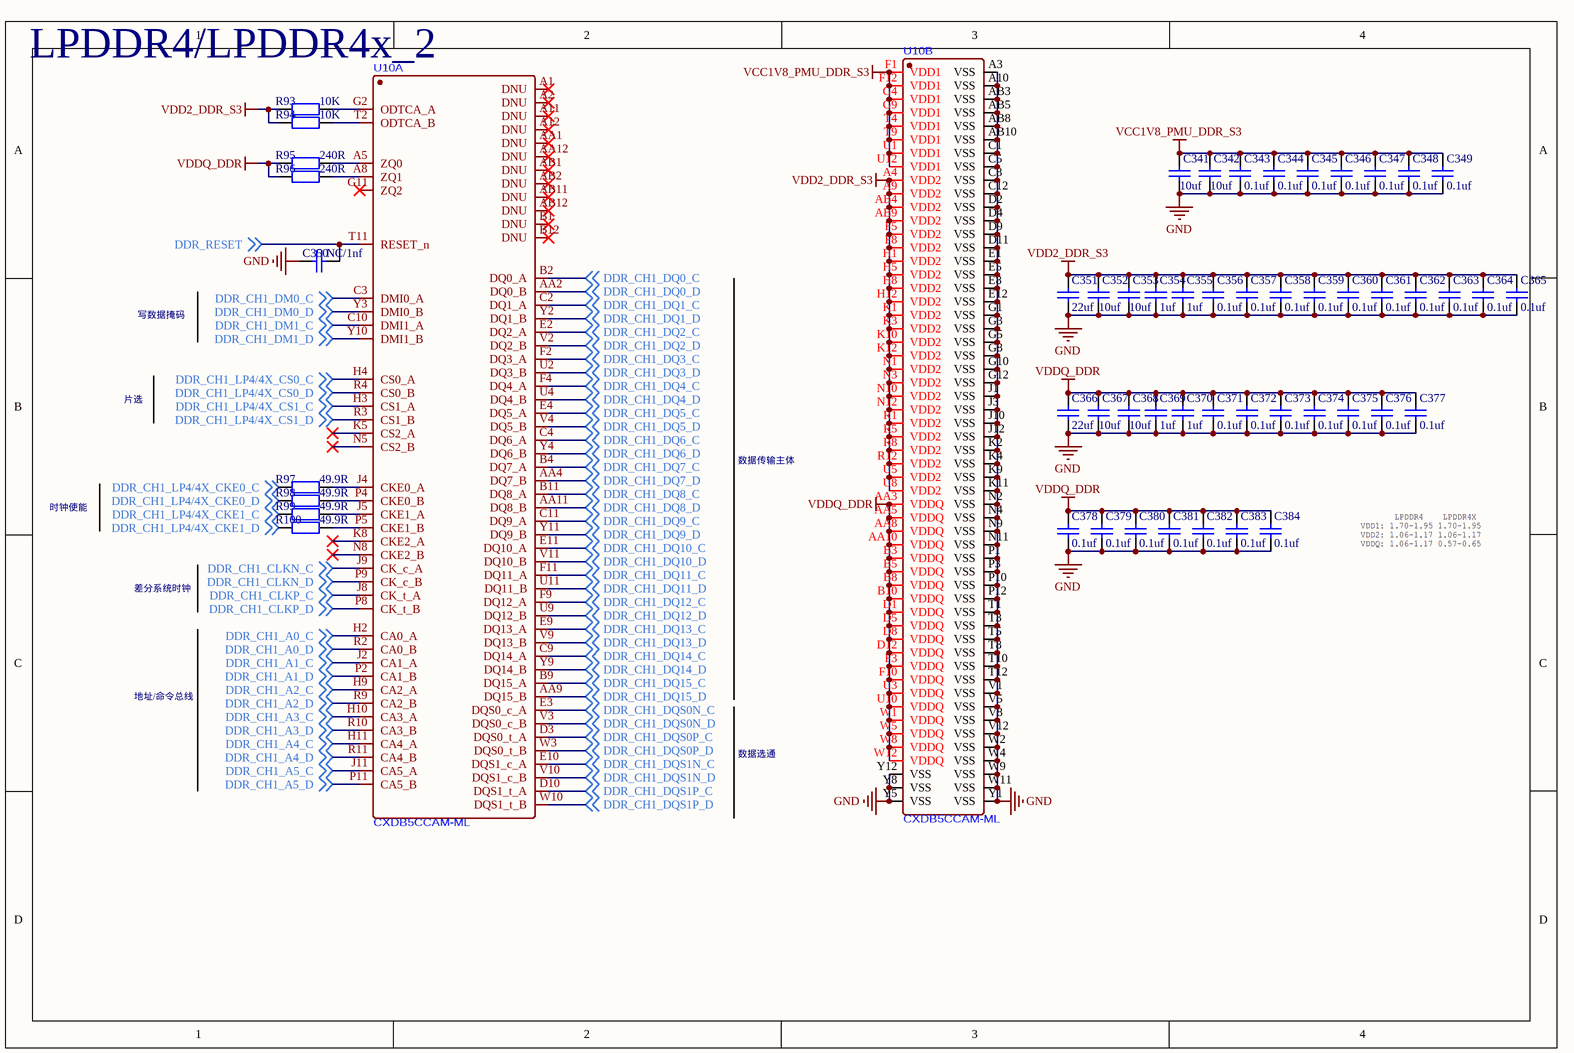
[diagram p17: 18.LPDDR4_LPDDR4x_2.SchDoc]

### Parts
C341  10uf  [C0402_L]
C342  10uf  [C0402_L]
C343  0.1uf  [C0201_L]
C344  0.1uf  [C0201_L]
C345  0.1uf  [C0201_L]
C346  0.1uf  [C0201_L]
C347  0.1uf  [C0201_L]
C348  0.1uf  [C0201_L]
C349  0.1uf  [C0201_L]
C350  NC/1nf  [C0201_L]
C351  22uf  [C0603_L]
C352  10uf  [C0402_L]
C353  10uf  [C0402_L]
C354  1uf  [C0201_L]
C355  1uf  [C0201_L]
C356  0.1uf  [C0201_L]
C357  0.1uf  [C0201_L]
C358  0.1uf  [C0201_L]
C359  0.1uf  [C0201_L]
C360  0.1uf  [C0201_L]
C361  0.1uf  [C0201_L]
C362  0.1uf  [C0201_L]
C363  0.1uf  [C0201_L]
C364  0.1uf  [C0201_L]
C365  0.1uf  [C0201_L]
C366  22uf  [C0603_L]
C367  10uf  [C0402_L]
C368  10uf  [C0402_L]
C369  1uf  [C0201_L]
C370  1uf  [C0201_L]
C371  0.1uf  [C0201_L]
C372  0.1uf  [C0201_L]
C373  0.1uf  [C0201_L]
C374  0.1uf  [C0201_L]
C375  0.1uf  [C0201_L]
C376  0.1uf  [C0201_L]
C377  0.1uf  [C0201_L]
C378  0.1uf  [C0201_L]
C379  0.1uf  [C0201_L]
C380  0.1uf  [C0201_L]
C381  0.1uf  [C0201_L]
C382  0.1uf  [C0201_L]
C383  0.1uf  [C0201_L]
C384  0.1uf  [C0201_L]
R93  10K  [R0201_L]
R94  10K  [R0201_L]
R95  240R  [R0201_L]
R96  240R  [R0201_L]
R97  49.9R  [R0201_L]
R98  49.9R  [R0201_L]
R99  49.9R  [R0201_L]
R100  49.9R  [R0201_L]
U10  CXDB5CCAM-ML  [FBGA-200_L15.0-W10.0-BL_K4F6E3S4HM]  (parts A,B of 2)

### Nets
GND: C341.1 C342.1 C343.1 C344.1 C345.1 C346.1 C347.1 C348.1 C349.1 C350.1 C351.1 C352.1 C353.1 C354.1 C355.1 C356.1 C357.1 C358.1 C359.1 C360.1 C361.1 C362.1 C363.1 C364.1 C365.1 C366.1 C367.1 C368.1 C369.1 C370.1 C371.1 C372.1 C373.1 C374.1 C375.1 C376.1 C377.1 C378.1 C379.1 C380.1 C381.1 C382.1 C383.1 C384.1 U10.A3(VSS) U10.A10(VSS) U10.AB3(VSS) U10.AB5(VSS) U10.AB8(VSS) U10.AB10(VSS) U10.C1(VSS) U10.C5(VSS) U10.C8(VSS) U10.C12(VSS) U10.D2(VSS) U10.D4(VSS) U10.D9(VSS) U10.D11(VSS) U10.E1(VSS) U10.E5(VSS) U10.E8(VSS) U10.E12(VSS) U10.G1(VSS) U10.G3(VSS) U10.G5(VSS) U10.G8(VSS) U10.G10(VSS) U10.G12(VSS) U10.J1(VSS) U10.J3(VSS) U10.J10(VSS) U10.J12(VSS) U10.K2(VSS) U10.K4(VSS) U10.K9(VSS) U10.K11(VSS) U10.N2(VSS) U10.N4(VSS) U10.N9(VSS) U10.N11(VSS) U10.P1(VSS) U10.P3(VSS) U10.P10(VSS) U10.P12(VSS) U10.T1(VSS) U10.T3(VSS) U10.T5(VSS) U10.T8(VSS) U10.T10(VSS) U10.T12(VSS) U10.V1(VSS) U10.V5(VSS) U10.V8(VSS) U10.V12(VSS) U10.W2(VSS) U10.W4(VSS) U10.W9(VSS) U10.W11(VSS) U10.Y1(VSS) U10.Y5(VSS) U10.Y8(VSS) U10.Y12(VSS)
VCC1V8_PMU_DDR_S3: C341.2 C342.2 C343.2 C344.2 C345.2 C346.2 C347.2 C348.2 C349.2 U10.F1(VDD1) U10.F12(VDD1) U10.G4(VDD1) U10.G9(VDD1) U10.T4(VDD1) U10.T9(VDD1) U10.U1(VDD1) U10.U12(VDD1)
VDD2_DDR_S3: C351.2 C352.2 C353.2 C354.2 C355.2 C356.2 C357.2 C358.2 C359.2 C360.2 C361.2 C362.2 C363.2 C364.2 C365.2 R93.1 R94.1 U10.A4(VDD2) U10.A9(VDD2) U10.AB4(VDD2) U10.AB9(VDD2) U10.F5(VDD2) U10.F8(VDD2) U10.H1(VDD2) U10.H5(VDD2) U10.H8(VDD2) U10.H12(VDD2) U10.K1(VDD2) U10.K3(VDD2) U10.K10(VDD2) U10.K12(VDD2) U10.N1(VDD2) U10.N3(VDD2) U10.N10(VDD2) U10.N12(VDD2) U10.R1(VDD2) U10.R5(VDD2) U10.R8(VDD2) U10.R12(VDD2) U10.U5(VDD2) U10.U8(VDD2)
VDDQ_DDR: C366.2 C367.2 C368.2 C369.2 C370.2 C371.2 C372.2 C373.2 C374.2 C375.2 C376.2 C377.2 C378.2 C379.2 C380.2 C381.2 C382.2 C383.2 C384.2 R95.1 R96.1 U10.AA3(VDDQ) U10.AA5(VDDQ) U10.AA8(VDDQ) U10.AA10(VDDQ) U10.B3(VDDQ) U10.B5(VDDQ) U10.B8(VDDQ) U10.B10(VDDQ) U10.D1(VDDQ) U10.D5(VDDQ) U10.D8(VDDQ) U10.D12(VDDQ) U10.F3(VDDQ) U10.F10(VDDQ) U10.U3(VDDQ) U10.U10(VDDQ) U10.W1(VDDQ) U10.W5(VDDQ) U10.W8(VDDQ) U10.W12(VDDQ)
DDR_CH1_A0_C: U10.H2(CA0_A) ; off-sheet DDR_CH1_A0_C
DDR_CH1_A0_D: U10.R2(CA0_B) ; off-sheet DDR_CH1_A0_D
DDR_CH1_A1_C: U10.J2(CA1_A) ; off-sheet DDR_CH1_A1_C
DDR_CH1_A1_D: U10.P2(CA1_B) ; off-sheet DDR_CH1_A1_D
DDR_CH1_A2_C: U10.H9(CA2_A) ; off-sheet DDR_CH1_A2_C
DDR_CH1_A2_D: U10.R9(CA2_B) ; off-sheet DDR_CH1_A2_D
DDR_CH1_A3_C: U10.H10(CA3_A) ; off-sheet DDR_CH1_A3_C
DDR_CH1_A3_D: U10.R10(CA3_B) ; off-sheet DDR_CH1_A3_D
DDR_CH1_A4_C: U10.H11(CA4_A) ; off-sheet DDR_CH1_A4_C
DDR_CH1_A4_D: U10.R11(CA4_B) ; off-sheet DDR_CH1_A4_D
DDR_CH1_A5_C: U10.J11(CA5_A) ; off-sheet DDR_CH1_A5_C
DDR_CH1_A5_D: U10.P11(CA5_B) ; off-sheet DDR_CH1_A5_D
DDR_CH1_CLKN_C: U10.J9(CK_c_A) ; off-sheet DDR_CH1_CLKN_C
DDR_CH1_CLKN_D: U10.P9(CK_c_B) ; off-sheet DDR_CH1_CLKN_D
DDR_CH1_CLKP_C: U10.J8(CK_t_A) ; off-sheet DDR_CH1_CLKP_C
DDR_CH1_CLKP_D: U10.P8(CK_t_B) ; off-sheet DDR_CH1_CLKP_D
DDR_CH1_DM0_C: U10.C3(DMI0_A) ; off-sheet DDR_CH1_DM0_C
DDR_CH1_DM0_D: U10.Y3(DMI0_B) ; off-sheet DDR_CH1_DM0_D
DDR_CH1_DM1_C: U10.C10(DMI1_A) ; off-sheet DDR_CH1_DM1_C
DDR_CH1_DM1_D: U10.Y10(DMI1_B) ; off-sheet DDR_CH1_DM1_D
DDR_CH1_DQ0_C: U10.B2(DQ0_A) ; off-sheet DDR_CH1_DQ0_C
DDR_CH1_DQ0_D: U10.AA2(DQ0_B) ; off-sheet DDR_CH1_DQ0_D
DDR_CH1_DQ1_C: U10.C2(DQ1_A) ; off-sheet DDR_CH1_DQ1_C
DDR_CH1_DQ1_D: U10.Y2(DQ1_B) ; off-sheet DDR_CH1_DQ1_D
DDR_CH1_DQ2_C: U10.E2(DQ2_A) ; off-sheet DDR_CH1_DQ2_C
DDR_CH1_DQ2_D: U10.V2(DQ2_B) ; off-sheet DDR_CH1_DQ2_D
DDR_CH1_DQ3_C: U10.F2(DQ3_A) ; off-sheet DDR_CH1_DQ3_C
DDR_CH1_DQ3_D: U10.U2(DQ3_B) ; off-sheet DDR_CH1_DQ3_D
DDR_CH1_DQ4_C: U10.F4(DQ4_A) ; off-sheet DDR_CH1_DQ4_C
DDR_CH1_DQ4_D: U10.U4(DQ4_B) ; off-sheet DDR_CH1_DQ4_D
DDR_CH1_DQ5_C: U10.E4(DQ5_A) ; off-sheet DDR_CH1_DQ5_C
DDR_CH1_DQ5_D: U10.V4(DQ5_B) ; off-sheet DDR_CH1_DQ5_D
DDR_CH1_DQ6_C: U10.C4(DQ6_A) ; off-sheet DDR_CH1_DQ6_C
DDR_CH1_DQ6_D: U10.Y4(DQ6_B) ; off-sheet DDR_CH1_DQ6_D
DDR_CH1_DQ7_C: U10.B4(DQ7_A) ; off-sheet DDR_CH1_DQ7_C
DDR_CH1_DQ7_D: U10.AA4(DQ7_B) ; off-sheet DDR_CH1_DQ7_D
DDR_CH1_DQ8_C: U10.B11(DQ8_A) ; off-sheet DDR_CH1_DQ8_C
DDR_CH1_DQ8_D: U10.AA11(DQ8_B) ; off-sheet DDR_CH1_DQ8_D
DDR_CH1_DQ9_C: U10.C11(DQ9_A) ; off-sheet DDR_CH1_DQ9_C
DDR_CH1_DQ9_D: U10.Y11(DQ9_B) ; off-sheet DDR_CH1_DQ9_D
DDR_CH1_DQ10_C: U10.E11(DQ10_A) ; off-sheet DDR_CH1_DQ10_C
DDR_CH1_DQ10_D: U10.V11(DQ10_B) ; off-sheet DDR_CH1_DQ10_D
DDR_CH1_DQ11_C: U10.F11(DQ11_A) ; off-sheet DDR_CH1_DQ11_C
DDR_CH1_DQ11_D: U10.U11(DQ11_B) ; off-sheet DDR_CH1_DQ11_D
DDR_CH1_DQ12_C: U10.F9(DQ12_A) ; off-sheet DDR_CH1_DQ12_C
DDR_CH1_DQ12_D: U10.U9(DQ12_B) ; off-sheet DDR_CH1_DQ12_D
DDR_CH1_DQ13_C: U10.E9(DQ13_A) ; off-sheet DDR_CH1_DQ13_C
DDR_CH1_DQ13_D: U10.V9(DQ13_B) ; off-sheet DDR_CH1_DQ13_D
DDR_CH1_DQ14_C: U10.C9(DQ14_A) ; off-sheet DDR_CH1_DQ14_C
DDR_CH1_DQ14_D: U10.Y9(DQ14_B) ; off-sheet DDR_CH1_DQ14_D
DDR_CH1_DQ15_C: U10.B9(DQ15_A) ; off-sheet DDR_CH1_DQ15_C
DDR_CH1_DQ15_D: U10.AA9(DQ15_B) ; off-sheet DDR_CH1_DQ15_D
DDR_CH1_DQS0N_C: U10.E3(DQS0_c_A) ; off-sheet DDR_CH1_DQS0N_C
DDR_CH1_DQS0N_D: U10.V3(DQS0_c_B) ; off-sheet DDR_CH1_DQS0N_D
DDR_CH1_DQS0P_C: U10.D3(DQS0_t_A) ; off-sheet DDR_CH1_DQS0P_C
DDR_CH1_DQS0P_D: U10.W3(DQS0_t_B) ; off-sheet DDR_CH1_DQS0P_D
DDR_CH1_DQS1N_C: U10.E10(DQS1_c_A) ; off-sheet DDR_CH1_DQS1N_C
DDR_CH1_DQS1N_D: U10.V10(DQS1_c_B) ; off-sheet DDR_CH1_DQS1N_D
DDR_CH1_DQS1P_C: U10.D10(DQS1_t_A) ; off-sheet DDR_CH1_DQS1P_C
DDR_CH1_DQS1P_D: U10.W10(DQS1_t_B) ; off-sheet DDR_CH1_DQS1P_D
DDR_CH1_LP4/4X_CKE0_C: R97.1 ; off-sheet DDR_CH1_LP4/4X_CKE0_C
DDR_CH1_LP4/4X_CKE0_D: R98.1 ; off-sheet DDR_CH1_LP4/4X_CKE0_D
DDR_CH1_LP4/4X_CKE1_C: R99.1 ; off-sheet DDR_CH1_LP4/4X_CKE1_C
DDR_CH1_LP4/4X_CKE1_D: R100.1 ; off-sheet DDR_CH1_LP4/4X_CKE1_D
DDR_CH1_LP4/4X_CS0_C: U10.H4(CS0_A) ; off-sheet DDR_CH1_LP4/4X_CS0_C
DDR_CH1_LP4/4X_CS0_D: U10.R4(CS0_B) ; off-sheet DDR_CH1_LP4/4X_CS0_D
DDR_CH1_LP4/4X_CS1_C: U10.H3(CS1_A) ; off-sheet DDR_CH1_LP4/4X_CS1_C
DDR_CH1_LP4/4X_CS1_D: U10.R3(CS1_B) ; off-sheet DDR_CH1_LP4/4X_CS1_D
DDR_RESET: C350.2 U10.T11(RESET_n) ; off-sheet DDR_RESET
NetR93_2: R93.2 U10.G2(ODTCA_A)
NetR94_2: R94.2 U10.T2(ODTCA_B)
NetR95_2: R95.2 U10.A5(ZQ0)
NetR96_2: R96.2 U10.A8(ZQ1)
NetR97_2: R97.2 U10.J4(CKE0_A)
NetR98_2: R98.2 U10.P4(CKE0_B)
NetR99_2: R99.2 U10.J5(CKE1_A)
NetR100_2: R100.2 U10.P5(CKE1_B)

Not connected (* = marked no-connect by the designer): U10 A1(DNU)* A2(DNU)* A11(DNU)* A12(DNU)* AA1(DNU)* AA12(DNU)* AB1(DNU)* AB2(DNU)* AB11(DNU)* AB12(DNU)* B1(DNU)* B12(DNU)* G11(ZQ2)* K5(CS2_A)* K8(CKE2_A)* N5(CS2_B)* N8(CKE2_B)*

### Notes on the sheet
- (near U10) LPDDR4/LPDDR4x_2
- 写数据掩码
- 片选
- 数据传输主体
- 时钟使能
- 差分系统时钟
- 地址/命令总线
- 数据选通

### Library data of the parts
C341-C384 = C: 贴片电容/MLCC电容
R93-R100 = R: 贴片电阻

## Sheet 19.EMMC_FLASH.SchDoc
size A4; SheetNumber: 19; SheetTotal: 21
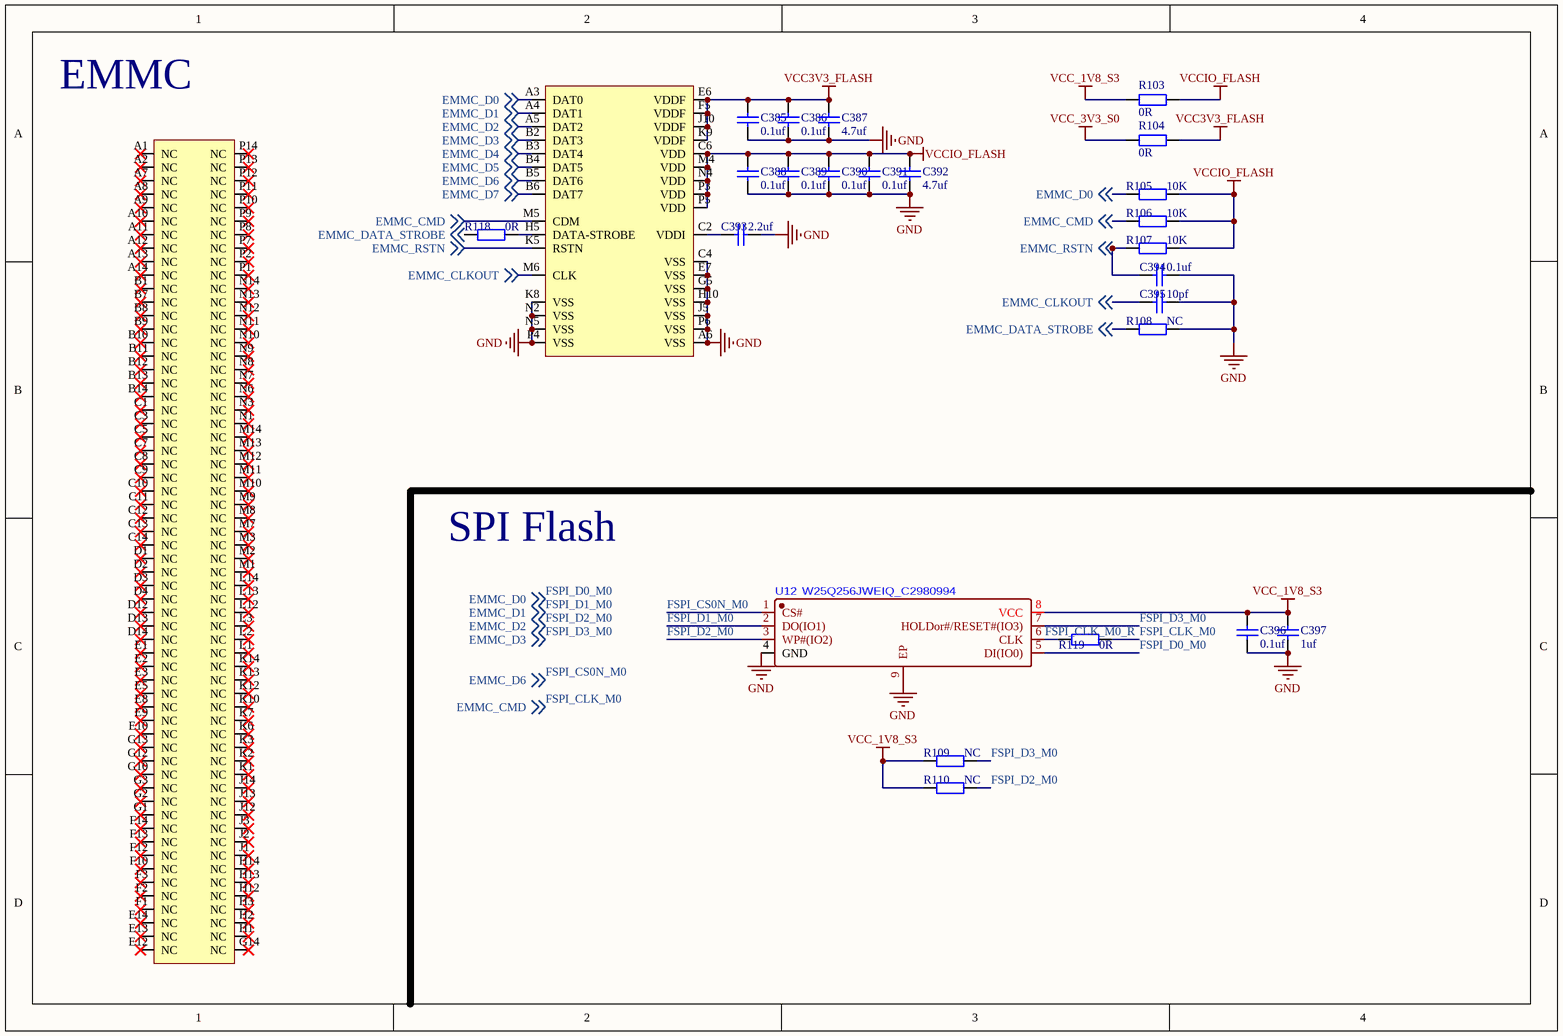
[diagram p18: 19.EMMC_FLASH.SchDoc]

### Parts
C385  0.1uf  [C0402_L]
C386  0.1uf  [C0402_L]
C387  4.7uf  [C0402_L]
C388  0.1uf  [C0402_L]
C389  0.1uf  [C0402_L]
C390  0.1uf  [C0402_L]
C391  0.1uf  [C0402_L]
C392  4.7uf  [C0402_L]
C393  2.2uf  [C0402_L]
C394  0.1uf  [C0402_L]
C395  10pf  [C0402_L]
C396  0.1uf  [C0201_L]
C397  1uf  [C0402_L]
R103  0R  [R0603_L]
R104  0R  [R0603_L]
R105  10K  [R0402_L]
R106  10K  [R0402_L]
R107  10K  [R0402_L]
R108  NC  [R0402_L]
R109  NC  [R0201_L]
R110  NC  [R0201_L]
R118  0R  [R0201_L]
R119  0R  [R0201_L]
U11  KLMBG2JETD-B041  [FBGA-153]  (value not drawn)  (parts A,B of 2)
U12  W25Q256JWEIQ_C2980994  [WSON-8_L8.0-W6.0-P1.27-TL-EP-1]

### Nets
GND: C385.2 C386.2 C387.2 C388.2 C389.2 C390.2 C391.2 C392.2 C393.1 C394.1 C395.1 C396.1 C397.1 R108.1 U11.A6(VSS) U11.C4(VSS) U11.E7(VSS) U11.G5(VSS) U11.H10(VSS) U11.J5(VSS) U11.K8(VSS) U11.N2(VSS) U11.N5(VSS) U11.P4(VSS) U11.P6(VSS) U12.4(GND) U12.9(EP)
VCC3V3_FLASH: C385.1 C386.1 C387.1 R104.2 U11.E6(VDDF) U11.F5(VDDF) U11.J10(VDDF) U11.K9(VDDF)
VCC_1V8_S3: C396.2 C397.2 R103.1 R109.1 R110.1 U12.8(VCC)  [project net VCC1V8_PMU_DDR_S3]
VCC_3V3_S0: R104.1
VCCIO_FLASH: C388.1 C389.1 C390.1 C391.1 C392.1 R103.2 R105.1 R106.1 R107.1 U11.C6(VDD) U11.M4(VDD) U11.N4(VDD) U11.P3(VDD) U11.P5(VDD)
EMMC_CLKOUT: C395.2 U11.M6(CLK) ; off-sheet EMMC_CLKOUT
EMMC_D4: U11.B3(DAT4) ; off-sheet EMMC_D4
EMMC_D5: U11.B4(DAT5) ; off-sheet EMMC_D5
EMMC_D7: U11.B6(DAT7) ; off-sheet EMMC_D7
EMMC_DATA_STROBE: R108.2 R118.1 ; off-sheet EMMC_DATA_STROBE
EMMC_RSTN: C394.2 R107.2 U11.K5(RSTN) ; off-sheet EMMC_RSTN
FSPI_CLK_M0: R106.2 R119.2 U11.M5(CDM) ; off-sheet EMMC_CMD  [also labelled EMMC_CMD]
FSPI_CLK_M0_R: R119.1 U12.6(CLK)
FSPI_CS0N_M0: U11.B5(DAT6) U12.1(CS#) ; off-sheet EMMC_D6  [also labelled EMMC_D6]
FSPI_D0_M0: R105.2 U11.A3(DAT0) U12.5(DI(IO0)) ; off-sheet EMMC_D0  [also labelled EMMC_D0]
FSPI_D1_M0: U11.A4(DAT1) U12.2(DO(IO1)) ; off-sheet EMMC_D1  [also labelled EMMC_D1]
FSPI_D2_M0: R110.2 U11.A5(DAT2) U12.3(WP#(IO2)) ; off-sheet EMMC_D2  [also labelled EMMC_D2]
FSPI_D3_M0: R109.2 U11.B2(DAT3) U12.7(HOLDor#/RESET#(IO3)) ; off-sheet EMMC_D3  [also labelled EMMC_D3]
NetC393_2: C393.2 U11.C2(VDDI)
NetR118_2: R118.2 U11.H5(DATA-STROBE)

Not connected (* = marked no-connect by the designer): U11 A1(NC)* A2(NC)* A7(NC)* A8(NC)* A9(NC)* A10(NC)* A11(NC)* A12(NC)* A13(NC)* A14(NC)* B1(NC)* B7(NC)* B8(NC)* B9(NC)* B10(NC)* B11(NC)* B12(NC)* B13(NC)* B14(NC)* C1(NC)* C3(NC)* C5(NC)* C7(NC)* C8(NC)* C9(NC)* C10(NC)* C11(NC)* C12(NC)* C13(NC)* C14(NC)* D1(NC)* D2(NC)* D3(NC)* D4(NC)* D12(NC)* D13(NC)* D14(NC)* E1(NC)* E2(NC)* E3(NC)* E5(NC)* E8(NC)* E9(NC)* E10(NC)* E12(NC)* E13(NC)* E14(NC)* F1(NC)* F2(NC)* F3(NC)* F10(NC)* F12(NC)* F13(NC)* F14(NC)* G1(NC)* G2(NC)* G3(NC)* G10(NC)* G12(NC)* G13(NC)* G14(NC)* H1(NC)* H2(NC)* H3(NC)* H12(NC)* H13(NC)* H14(NC)* J1(NC)* J2(NC)* J3(NC)* J12(NC)* J13(NC)* J14(NC)* K1(NC)* K2(NC)* K3(NC)* K6(NC)* K7(NC)* K10(NC)* K12(NC)* K13(NC)* K14(NC)* L1(NC)* L2(NC)* L3(NC)* L12(NC)* L13(NC)* L14(NC)* M1(NC)* M2(NC)* M3(NC)* M7(NC)* M8(NC)* M9(NC)* M10(NC)* M11(NC)* M12(NC)* M13(NC)* M14(NC)* N1(NC)* N3(NC)* N6(NC)* N7(NC)* N8(NC)* N9(NC)* N10(NC)* N11(NC)* N12(NC)* N13(NC)* N14(NC)* P1(NC)* P2(NC)* P7(NC)* P8(NC)* P9(NC)* P10(NC)* P11(NC)* P12(NC)* P13(NC)* P14(NC)*

### Notes on the sheet
- EMMC
- SPI Flash

### Library data of the parts
C385-C397 = C: 贴片电容/MLCC电容
R103-R110 R118 R119 = R: 贴片电阻
U11 = KLMBG2JETD-B041: 32GB EMMC5.1